# EAGLE design cape_rev_a (EAGLE 7.3.0)
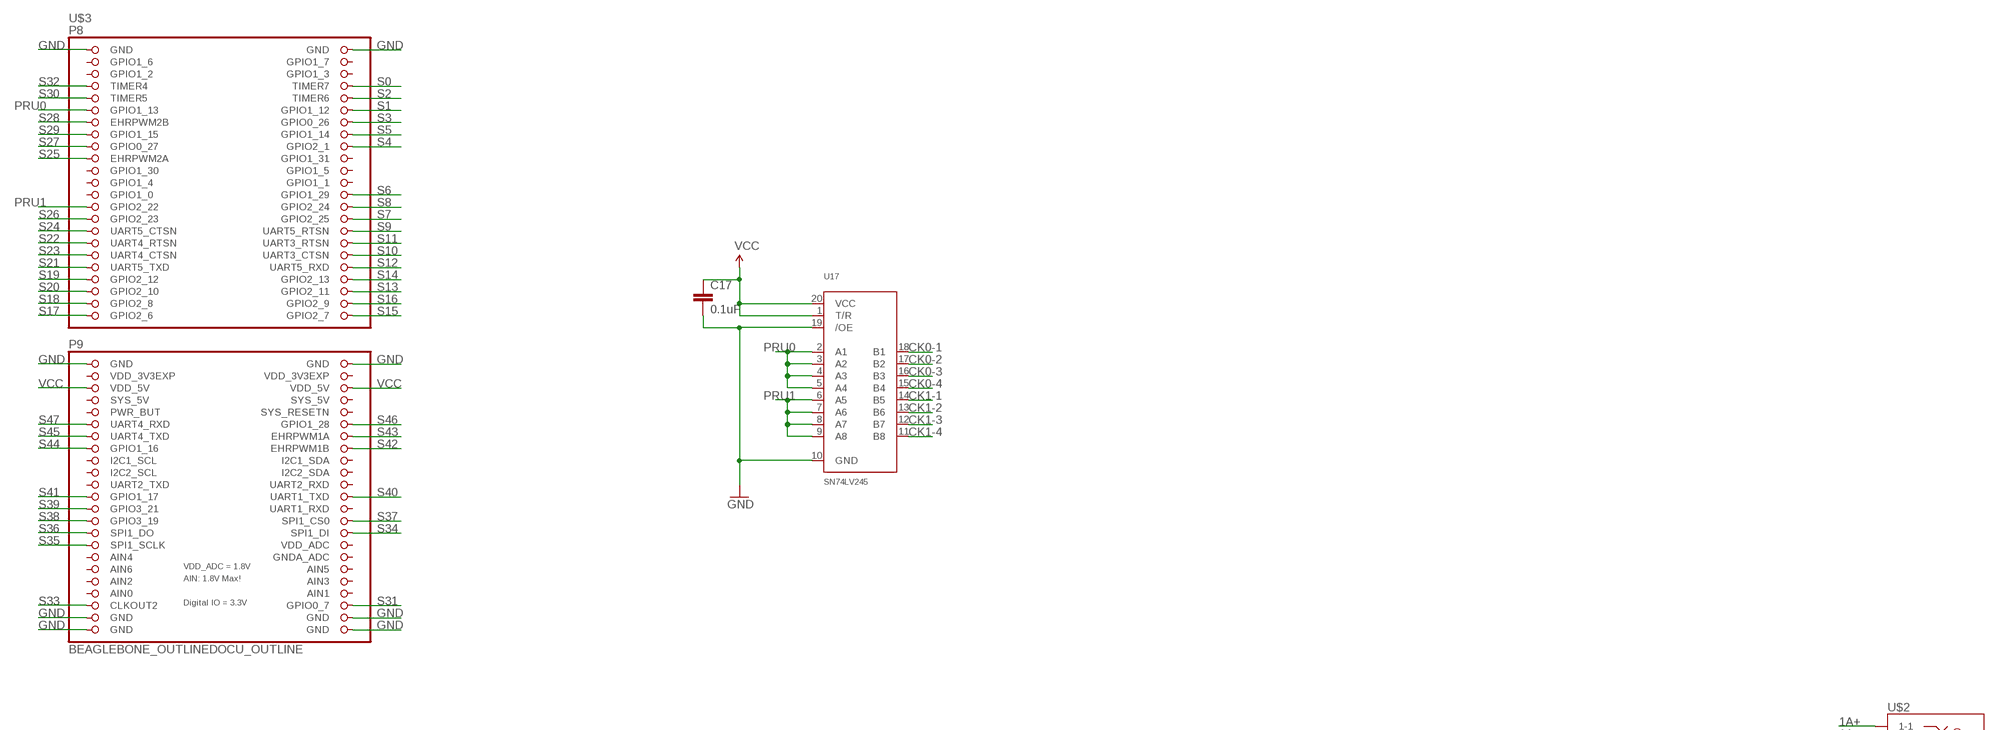
[diagram p0: schematic, sheet 1, part 1 of 2]
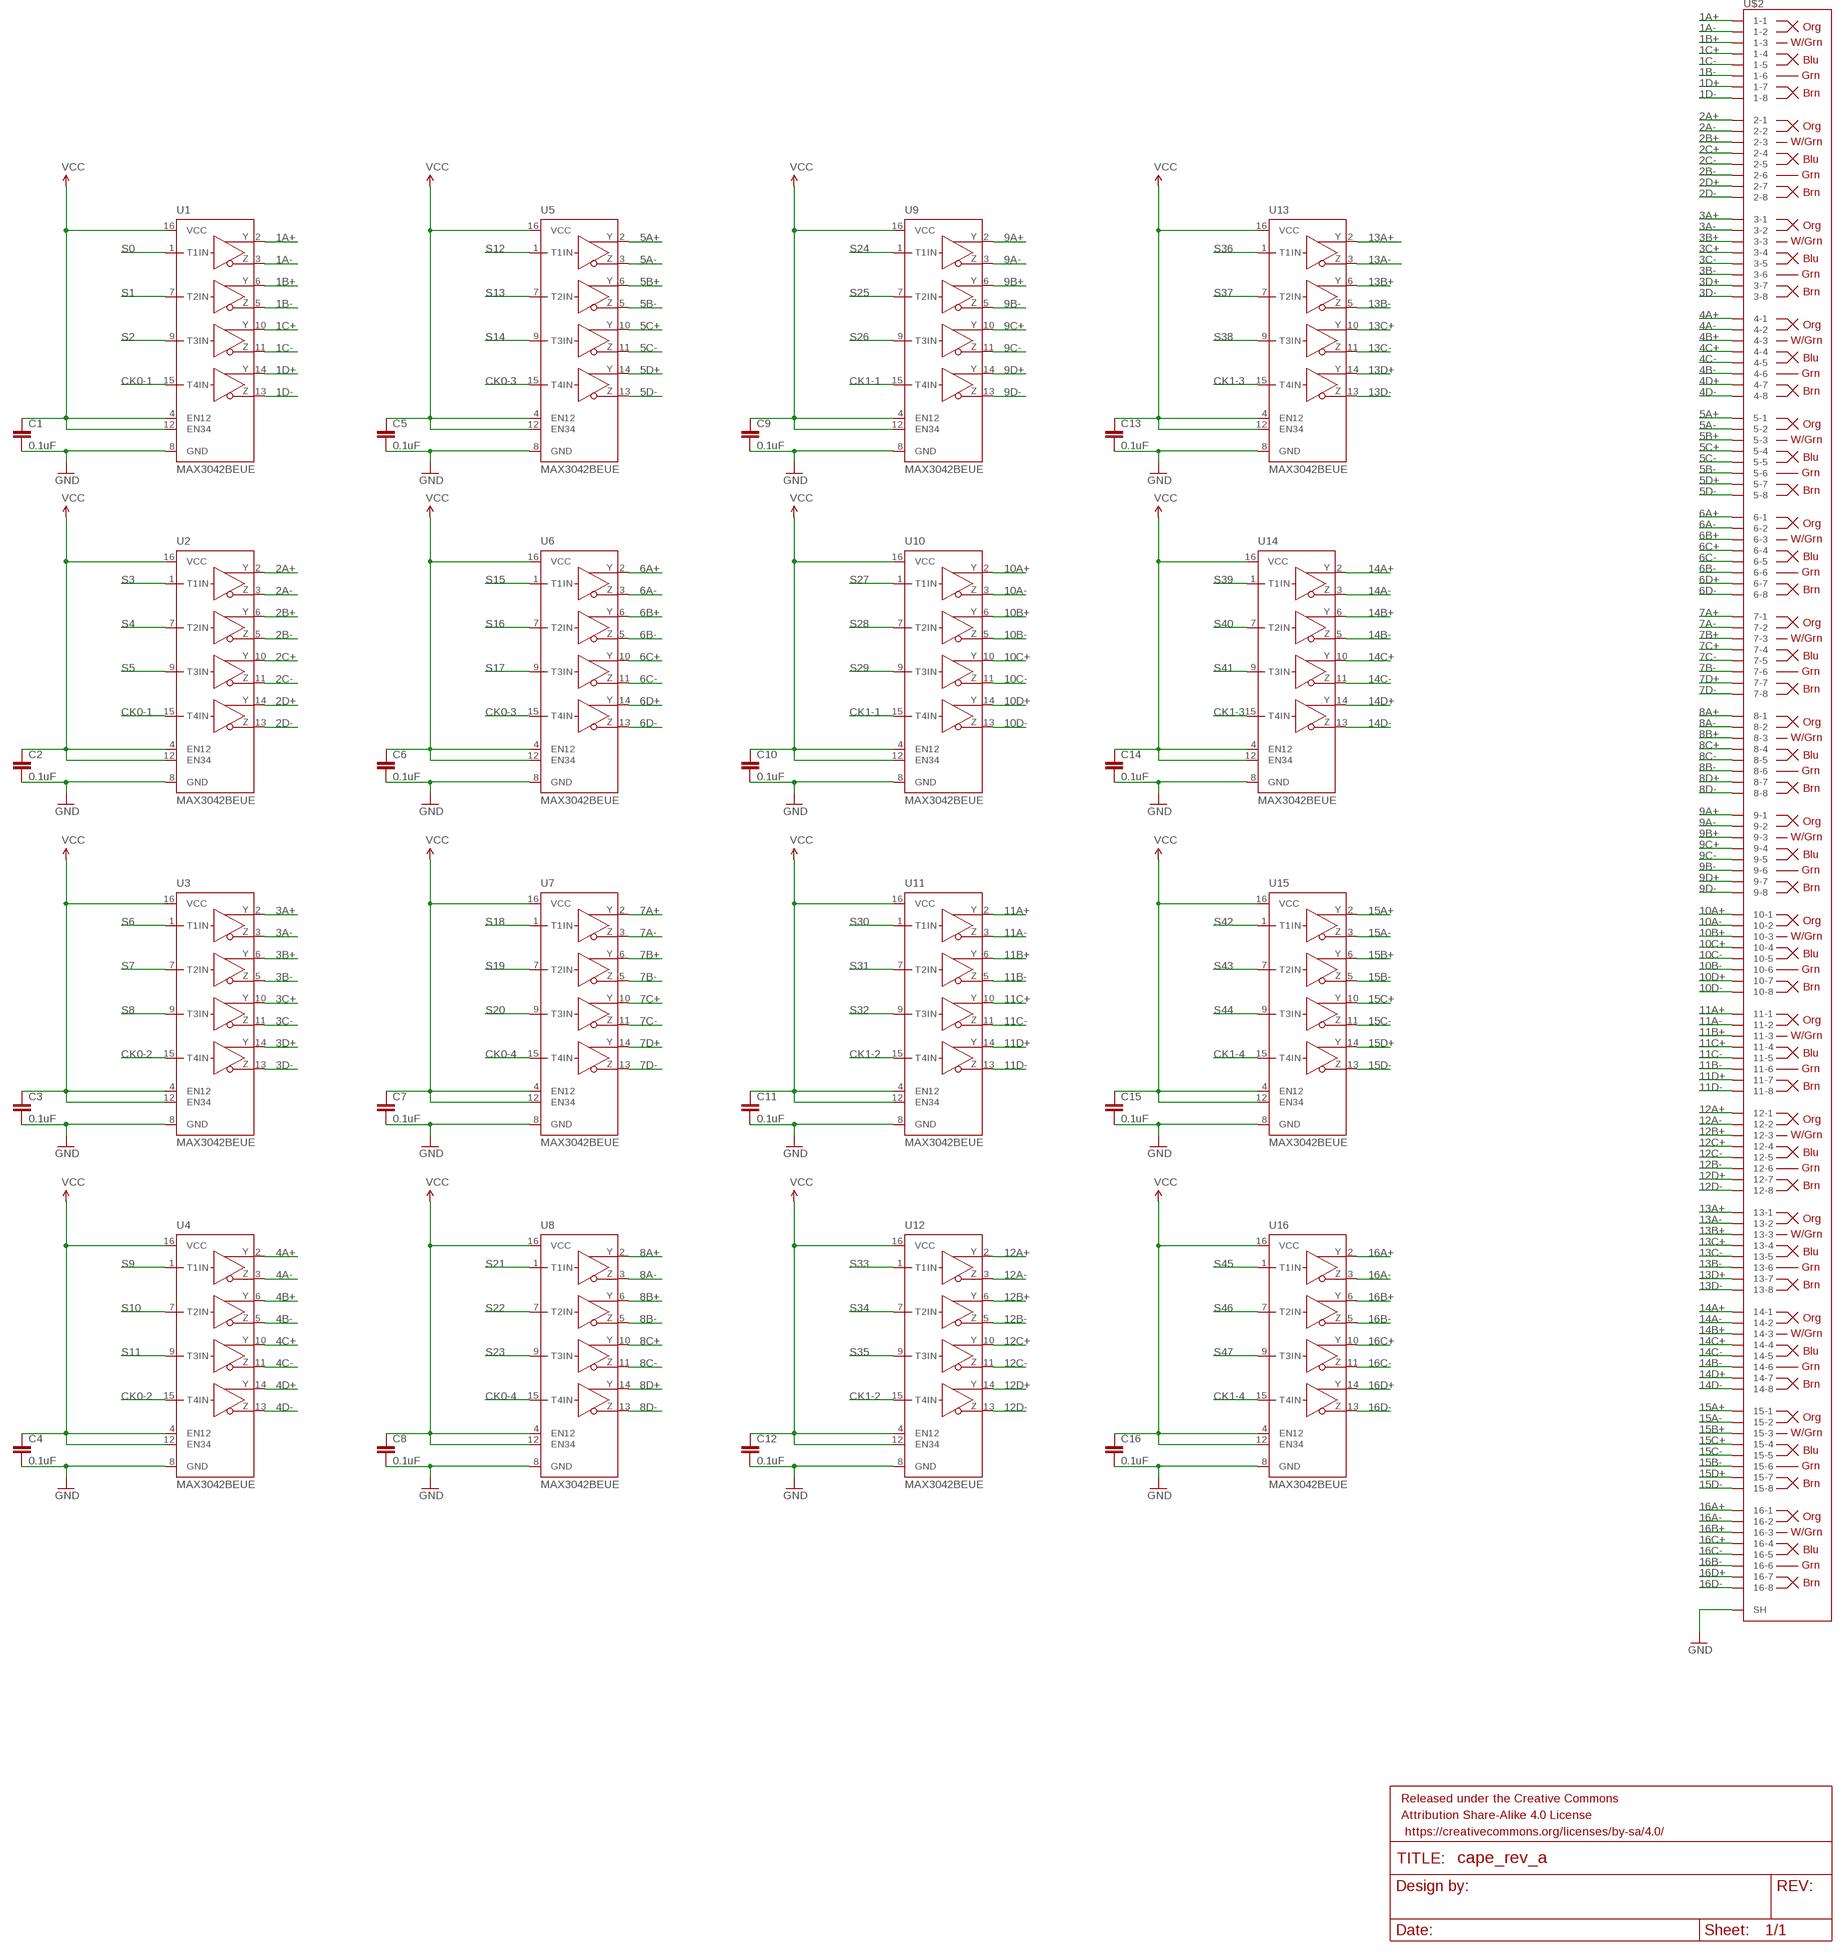
[diagram p1: schematic, sheet 1, part 2 of 2]

## Parts
C1  0.1uF  CAP0603-CAP  [0603-CAP]
C2  0.1uF  CAP0603-CAP  [0603-CAP]
C3  0.1uF  CAP0603-CAP  [0603-CAP]
C4  0.1uF  CAP0603-CAP  [0603-CAP]
C5  0.1uF  CAP0603-CAP  [0603-CAP]
C6  0.1uF  CAP0603-CAP  [0603-CAP]
C7  0.1uF  CAP0603-CAP  [0603-CAP]
C8  0.1uF  CAP0603-CAP  [0603-CAP]
C9  0.1uF  CAP0603-CAP  [0603-CAP]
C10  0.1uF  CAP0603-CAP  [0603-CAP]
C11  0.1uF  CAP0603-CAP  [0603-CAP]
C12  0.1uF  CAP0603-CAP  [0603-CAP]
C13  0.1uF  CAP0603-CAP  [0603-CAP]
C14  0.1uF  CAP0603-CAP  [0603-CAP]
C15  0.1uF  CAP0603-CAP  [0603-CAP]
C16  0.1uF  CAP0603-CAP  [0603-CAP]
C17  0.1uF  CAP0603-CAP  [0603-CAP]
FRAME1  FRAME-LETTERNO_PACKAGE  [DUMMY]
U1  MAX3042BEUE  [TSSOP16]
U2  MAX3042BEUE  [TSSOP16]
U3  MAX3042BEUE  [TSSOP16]
U4  MAX3042BEUE  [TSSOP16]
U5  MAX3042BEUE  [TSSOP16]
U6  MAX3042BEUE  [TSSOP16]
U7  MAX3042BEUE  [TSSOP16]
U8  MAX3042BEUE  [TSSOP16]
U9  MAX3042BEUE  [TSSOP16]
U10  MAX3042BEUE  [TSSOP16]
U11  MAX3042BEUE  [TSSOP16]
U12  MAX3042BEUE  [TSSOP16]
U13  MAX3042BEUE  [TSSOP16]
U14  MAX3042BEUE  [TSSOP16]
U15  MAX3042BEUE  [TSSOP16]
U16  MAX3042BEUE  [TSSOP16]
U17  SN74LV245  74LCX245  [TSSOP20]
U$2  RJ45-16  [5569264-1]
U$3  BEAGLEBONE_OUTLINEDOCU_OUTLINE  [BEAGLEBONE_OUTLINE_DOCU]

## Nets
1A+: U1.2(Y1) U$2.P1-1(1-1)
1A-: U1.3(Z1) U$2.P1-2(1-2)
1B+: U1.6(Y2) U$2.P1-3(1-3)
1B-: U1.5(Z2) U$2.P1-6(1-6)
1C+: U1.10(Y3) U$2.P1-4(1-4)
1C-: U1.11(Z3) U$2.P1-5(1-5)
1D+: U1.14(Y4) U$2.P1-7(1-7)
1D-: U1.13(Z4) U$2.P1-8(1-8)
2A+: U2.2(Y1) U$2.P2-1(2-1)
2A-: U2.3(Z1) U$2.P2-2(2-2)
2B+: U2.6(Y2) U$2.P2-3(2-3)
2B-: U2.5(Z2) U$2.P2-6(2-6)
2C+: U2.10(Y3) U$2.P2-4(2-4)
2C-: U2.11(Z3) U$2.P2-5(2-5)
2D+: U2.14(Y4) U$2.P2-7(2-7)
2D-: U2.13(Z4) U$2.P2-8(2-8)
3A+: U3.2(Y1) U$2.P3-1(3-1)
3A-: U3.3(Z1) U$2.P3-2(3-2)
3B+: U3.6(Y2) U$2.P3-3(3-3)
3B-: U3.5(Z2) U$2.P3-6(3-6)
3C+: U3.10(Y3) U$2.P3-4(3-4)
3C-: U3.11(Z3) U$2.P3-5(3-5)
3D+: U3.14(Y4) U$2.P3-7(3-7)
3D-: U3.13(Z4) U$2.P3-8(3-8)
4A+: U4.2(Y1) U$2.P4-1(4-1)
4A-: U4.3(Z1) U$2.P4-2(4-2)
4B+: U4.6(Y2) U$2.P4-3(4-3)
4B-: U4.5(Z2) U$2.P4-6(4-6)
4C+: U4.10(Y3) U$2.P4-4(4-4)
4C-: U4.11(Z3) U$2.P4-5(4-5)
4D+: U4.14(Y4) U$2.P4-7(4-7)
4D-: U4.13(Z4) U$2.P4-8(4-8)
5A+: U5.2(Y1) U$2.P5-1(5-1)
5A-: U5.3(Z1) U$2.P5-2(5-2)
5B+: U5.6(Y2) U$2.P5-3(5-3)
5B-: U5.5(Z2) U$2.P5-6(5-6)
5C+: U5.10(Y3) U$2.P5-4(5-4)
5C-: U5.11(Z3) U$2.P5-5(5-5)
5D+: U5.14(Y4) U$2.P5-7(5-7)
5D-: U5.13(Z4) U$2.P5-8(5-8)
6A+: U6.2(Y1) U$2.P6-1(6-1)
6A-: U6.3(Z1) U$2.P6-2(6-2)
6B+: U6.6(Y2) U$2.P6-3(6-3)
6B-: U6.5(Z2) U$2.P6-6(6-6)
6C+: U6.10(Y3) U$2.P6-4(6-4)
6C-: U6.11(Z3) U$2.P6-5(6-5)
6D+: U6.14(Y4) U$2.P6-7(6-7)
6D-: U6.13(Z4) U$2.P6-8(6-8)
7A+: U7.2(Y1) U$2.P7-1(7-1)
7A-: U7.3(Z1) U$2.P7-2(7-2)
7B+: U7.6(Y2) U$2.P7-3(7-3)
7B-: U7.5(Z2) U$2.P7-6(7-6)
7C+: U7.10(Y3) U$2.P7-4(7-4)
7C-: U7.11(Z3) U$2.P7-5(7-5)
7D+: U7.14(Y4) U$2.P7-7(7-7)
7D-: U7.13(Z4) U$2.P7-8(7-8)
8A+: U8.2(Y1) U$2.P8-1(8-1)
8A-: U8.3(Z1) U$2.P8-2(8-2)
8B+: U8.6(Y2) U$2.P8-3(8-3)
8B-: U8.5(Z2) U$2.P8-6(8-6)
8C+: U8.10(Y3) U$2.P8-4(8-4)
8C-: U8.11(Z3) U$2.P8-5(8-5)
8D+: U8.14(Y4) U$2.P8-7(8-7)
8D-: U8.13(Z4) U$2.P8-8(8-8)
9A+: U9.2(Y1) U$2.P9-1(9-1)
9A-: U9.3(Z1) U$2.P9-2(9-2)
9B+: U9.6(Y2) U$2.P9-3(9-3)
9B-: U9.5(Z2) U$2.P9-6(9-6)
9C+: U9.10(Y3) U$2.P9-4(9-4)
9C-: U9.11(Z3) U$2.P9-5(9-5)
9D+: U9.14(Y4) U$2.P9-7(9-7)
9D-: U9.13(Z4) U$2.P9-8(9-8)
10A+: U10.2(Y1) U$2.P10-1(10-1)
10A-: U10.3(Z1) U$2.P10-2(10-2)
10B+: U10.6(Y2) U$2.P10-3(10-3)
10B-: U10.5(Z2) U$2.P10-6(10-6)
10C+: U10.10(Y3) U$2.P10-4(10-4)
10C-: U10.11(Z3) U$2.P10-5(10-5)
10D+: U10.14(Y4) U$2.P10-7(10-7)
10D-: U10.13(Z4) U$2.P10-8(10-8)
11A+: U11.2(Y1) U$2.P11-1(11-1)
11A-: U11.3(Z1) U$2.P11-2(11-2)
11B+: U11.6(Y2) U$2.P11-3(11-3)
11B-: U11.5(Z2) U$2.P11-6(11-6)
11C+: U11.10(Y3) U$2.P11-4(11-4)
11C-: U11.11(Z3) U$2.P11-5(11-5)
11D+: U11.14(Y4) U$2.P11-7(11-7)
11D-: U11.13(Z4) U$2.P11-8(11-8)
12A+: U12.2(Y1) U$2.P12-1(12-1)
12A-: U12.3(Z1) U$2.P12-2(12-2)
12B+: U12.6(Y2) U$2.P12-3(12-3)
12B-: U12.5(Z2) U$2.P12-6(12-6)
12C+: U12.10(Y3) U$2.P12-4(12-4)
12C-: U12.11(Z3) U$2.P12-5(12-5)
12D+: U12.14(Y4) U$2.P12-7(12-7)
12D-: U12.13(Z4) U$2.P12-8(12-8)
13A+: U13.2(Y1) U$2.P13-1(13-1)
13A-: U13.3(Z1) U$2.P13-2(13-2)
13B+: U13.6(Y2) U$2.P13-3(13-3)
13B-: U13.5(Z2) U$2.P13-6(13-6)
13C+: U13.10(Y3) U$2.P13-4(13-4)
13C-: U13.11(Z3) U$2.P13-5(13-5)
13D+: U13.14(Y4) U$2.P13-7(13-7)
13D-: U13.13(Z4) U$2.P13-8(13-8)
14A+: U14.2(Y1) U$2.P14-1(14-1)
14A-: U14.3(Z1) U$2.P14-2(14-2)
14B+: U14.6(Y2) U$2.P14-3(14-3)
14B-: U14.5(Z2) U$2.P14-6(14-6)
14C+: U14.10(Y3) U$2.P14-4(14-4)
14C-: U14.11(Z3) U$2.P14-5(14-5)
14D+: U14.14(Y4) U$2.P14-7(14-7)
14D-: U14.13(Z4) U$2.P14-8(14-8)
15A+: U15.2(Y1) U$2.P15-1(15-1)
15A-: U15.3(Z1) U$2.P15-2(15-2)
15B+: U15.6(Y2) U$2.P15-3(15-3)
15B-: U15.5(Z2) U$2.P15-6(15-6)
15C+: U15.10(Y3) U$2.P15-4(15-4)
15C-: U15.11(Z3) U$2.P15-5(15-5)
15D+: U15.14(Y4) U$2.P15-7(15-7)
15D-: U15.13(Z4) U$2.P15-8(15-8)
16A+: U16.2(Y1) U$2.P16-1(16-1)
16A-: U16.3(Z1) U$2.P16-2(16-2)
16B+: U16.6(Y2) U$2.P16-3(16-3)
16B-: U16.5(Z2) U$2.P16-6(16-6)
16C+: U16.10(Y3) U$2.P16-4(16-4)
16C-: U16.11(Z3) U$2.P16-5(16-5)
16D+: U16.14(Y4) U$2.P16-7(16-7)
16D-: U16.13(Z4) U$2.P16-8(16-8)
CK0-1: U1.15(T4IN) U2.15(T4IN) U17.18(B1)
CK0-2: U3.15(T4IN) U4.15(T4IN) U17.17(B2)
CK0-3: U5.15(T4IN) U6.15(T4IN) U17.16(B3)
CK0-4: U7.15(T4IN) U8.15(T4IN) U17.15(B4)
CK1-1: U9.15(T4IN) U10.15(T4IN) U17.14(B5)
CK1-2: U11.15(T4IN) U12.15(T4IN) U17.13(B6)
CK1-3: U13.15(T4IN) U14.15(T4IN) U17.12(B7)
CK1-4: U15.15(T4IN) U16.15(T4IN) U17.11(B8)
GND: C1.2 C2.2 C3.2 C4.2 C5.2 C6.2 C7.2 C8.2 C9.2 C10.2 C11.2 C12.2 C13.2 C14.2 C15.2 C16.2 C17.2 U1.8(GND) U2.8(GND) U3.8(GND) U4.8(GND) U5.8(GND) U6.8(GND) U7.8(GND) U8.8(GND) U9.8(GND) U10.8(GND) U11.8(GND) U12.8(GND) U13.8(GND) U14.8(GND) U15.8(GND) U16.8(GND) U17.10(GND) U17.19(/OE) U$2.SH@1(SH) U$2.SH@2(SH) U$2.SH@3(SH) U$2.SH@4(SH) U$2.SH@5(SH) U$2.SH@6(SH) U$3.1(GND) U$3.2(GND) U$3.47(GND) U$3.48(GND) U$3.89(GND) U$3.90(GND) U$3.91(GND) U$3.92(GND)
PRU0: U17.2(A1) U17.3(A2) U17.4(A3) U17.5(A4) U$3.11(GPIO1_13)
PRU1: U17.6(A5) U17.7(A6) U17.8(A7) U17.9(A8) U$3.27(GPIO2_22)
S0: U1.1(T1IN) U$3.8(TIMER7)
S1: U1.7(T2IN) U$3.12(GPIO1_12)
S2: U1.9(T3IN) U$3.10(TIMER6)
S3: U2.1(T1IN) U$3.14(GPIO0_26)
S4: U2.7(T2IN) U$3.18(GPIO2_1)
S5: U2.9(T3IN) U$3.16(GPIO1_14)
S6: U3.1(T1IN) U$3.26(GPIO1_29)
S7: U3.7(T2IN) U$3.30(GPIO2_25)
S8: U3.9(T3IN) U$3.28(GPIO2_24)
S9: U4.1(T1IN) U$3.32(UART5_RTSN)
S10: U4.7(T2IN) U$3.36(UART3_CTSN)
S11: U4.9(T3IN) U$3.34(UART3_RTSN)
S12: U5.1(T1IN) U$3.38(UART5_RXD)
S13: U5.7(T2IN) U$3.42(GPIO2_11)
S14: U5.9(T3IN) U$3.40(GPIO2_13)
S15: U6.1(T1IN) U$3.46(GPIO2_7)
S16: U6.7(T2IN) U$3.44(GPIO2_9)
S17: U6.9(T3IN) U$3.45(GPIO2_6)
S18: U7.1(T1IN) U$3.43(GPIO2_8)
S19: U7.7(T2IN) U$3.39(GPIO2_12)
S20: U7.9(T3IN) U$3.41(GPIO2_10)
S21: U8.1(T1IN) U$3.37(UART5_TXD)
S22: U8.7(T2IN) U$3.33(UART4_RTSN)
S23: U8.9(T3IN) U$3.35(UART4_CTSN)
S24: U9.1(T1IN) U$3.31(UART5_CTSN)
S25: U9.7(T2IN) U$3.19(EHRPWM2A)
S26: U9.9(T3IN) U$3.29(GPIO2_23)
S27: U10.1(T1IN) U$3.17(GPIO0_27)
S28: U10.7(T2IN) U$3.13(EHRPWM2B)
S29: U10.9(T3IN) U$3.15(GPIO1_15)
S30: U11.1(T1IN) U$3.9(TIMER5)
S31: U11.7(T2IN) U$3.88(GPIO0_7)
S32: U11.9(T3IN) U$3.7(TIMER4)
S33: U12.1(T1IN) U$3.87(CLKOUT2)
S34: U12.7(T2IN) U$3.76(SPI1_DI)
S35: U12.9(T3IN) U$3.77(SPI1_SCLK)
S36: U13.1(T1IN) U$3.75(SPI1_DO)
S37: U13.7(T2IN) U$3.74(SPI1_CS0)
S38: U13.9(T3IN) U$3.73(GPIO3_19)
S39: U14.1(T1IN) U$3.71(GPIO3_21)
S40: U14.7(T2IN) U$3.70(UART1_TXD)
S41: U14.9(T3IN) U$3.69(GPIO1_17)
S42: U15.1(T1IN) U$3.62(EHRPWM1B)
S43: U15.7(T2IN) U$3.60(EHRPWM1A)
S44: U15.9(T3IN) U$3.61(GPIO1_16)
S45: U16.1(T1IN) U$3.59(UART4_TXD)
S46: U16.7(T2IN) U$3.58(GPIO1_28)
S47: U16.9(T3IN) U$3.57(UART4_RXD)
VCC: C1.1 C2.1 C3.1 C4.1 C5.1 C6.1 C7.1 C8.1 C9.1 C10.1 C11.1 C12.1 C13.1 C14.1 C15.1 C16.1 C17.1 U1.4(EN12) U1.12(EN34) U1.16(VCC) U2.4(EN12) U2.12(EN34) U2.16(VCC) U3.4(EN12) U3.12(EN34) U3.16(VCC) U4.4(EN12) U4.12(EN34) U4.16(VCC) U5.4(EN12) U5.12(EN34) U5.16(VCC) U6.4(EN12) U6.12(EN34) U6.16(VCC) U7.4(EN12) U7.12(EN34) U7.16(VCC) U8.4(EN12) U8.12(EN34) U8.16(VCC) U9.4(EN12) U9.12(EN34) U9.16(VCC) U10.4(EN12) U10.12(EN34) U10.16(VCC) U11.4(EN12) U11.12(EN34) U11.16(VCC) U12.4(EN12) U12.12(EN34) U12.16(VCC) U13.4(EN12) U13.12(EN34) U13.16(VCC) U14.4(EN12) U14.12(EN34) U14.16(VCC) U15.4(EN12) U15.12(EN34) U15.16(VCC) U16.4(EN12) U16.12(EN34) U16.16(VCC) U17.1(T/R) U17.20(VCC) U$3.51(VDD_5V) U$3.52(VDD_5V)
Unconnected: U$3.3(GPIO1_6) U$3.4(GPIO1_7) U$3.5(GPIO1_2) U$3.6(GPIO1_3) U$3.20(GPIO1_31) U$3.21(GPIO1_30) U$3.22(GPIO1_5) U$3.23(GPIO1_4) U$3.24(GPIO1_1) U$3.25(GPIO1_0) U$3.55(PWR_BUT) U$3.56(SYS_RESETN) U$3.63(I2C1_SCL) U$3.64(I2C1_SDA) U$3.65(I2C2_SCL) U$3.66(I2C2_SDA) U$3.67(UART2_TXD) U$3.68(UART2_RXD) U$3.72(UART1_RXD) U$3.79(AIN4) U$3.81(AIN6) U$3.82(AIN5) U$3.83(AIN2) U$3.84(AIN3) U$3.85(AIN0) U$3.86(AIN1)

## Power pins joined to a net without a drawn wire
GNDA_ADC: U$3.80(GNDA_ADC)
SYS_5V: U$3.53(SYS_5V) U$3.54(SYS_5V)
VDD_3V3EXP: U$3.49(VDD_3V3EXP) U$3.50(VDD_3V3EXP)
VDD_ADC: U$3.78(VDD_ADC)

## Library data of the parts
C1-C17 = SparkFun-Passives:CAP: Capacitor Standard 0603 ceramic capacitor, and 0.1" leaded capacitor.
FRAME1 = SparkFun-Aesthetics:FRAME-LETTER: Schematic Frame Standard 8.5x11 US Letter frame; DESIGNER: Nobody; VERSION: v01
U1-U16 = maxim:MAX30*: ±10kV ESD-Protected, Quad 5V RS-485/RS-422 Transmitters Source: www.maxim-ic.com .. MAX3040-MAX3045.pdf; MPN: MAX3042BEUE+; OC_FARNELL: unknown; OC_NEWARK: 57K8796
U17 = microbuilder:74LCX245: 74LCX245MTC - 5.0V Tolerant Bi-Directional Buffer Can be used to interface 5.0V logic to 2.5 or 3.3V devices Digikey: 74LCX245MTCXTR-ND Mouser: 512-74LCX245MTCX
U$2 = Custom:RJ45-16
U$3 = microbuilder:BEAGLEBONE_OUTLINE

## Board
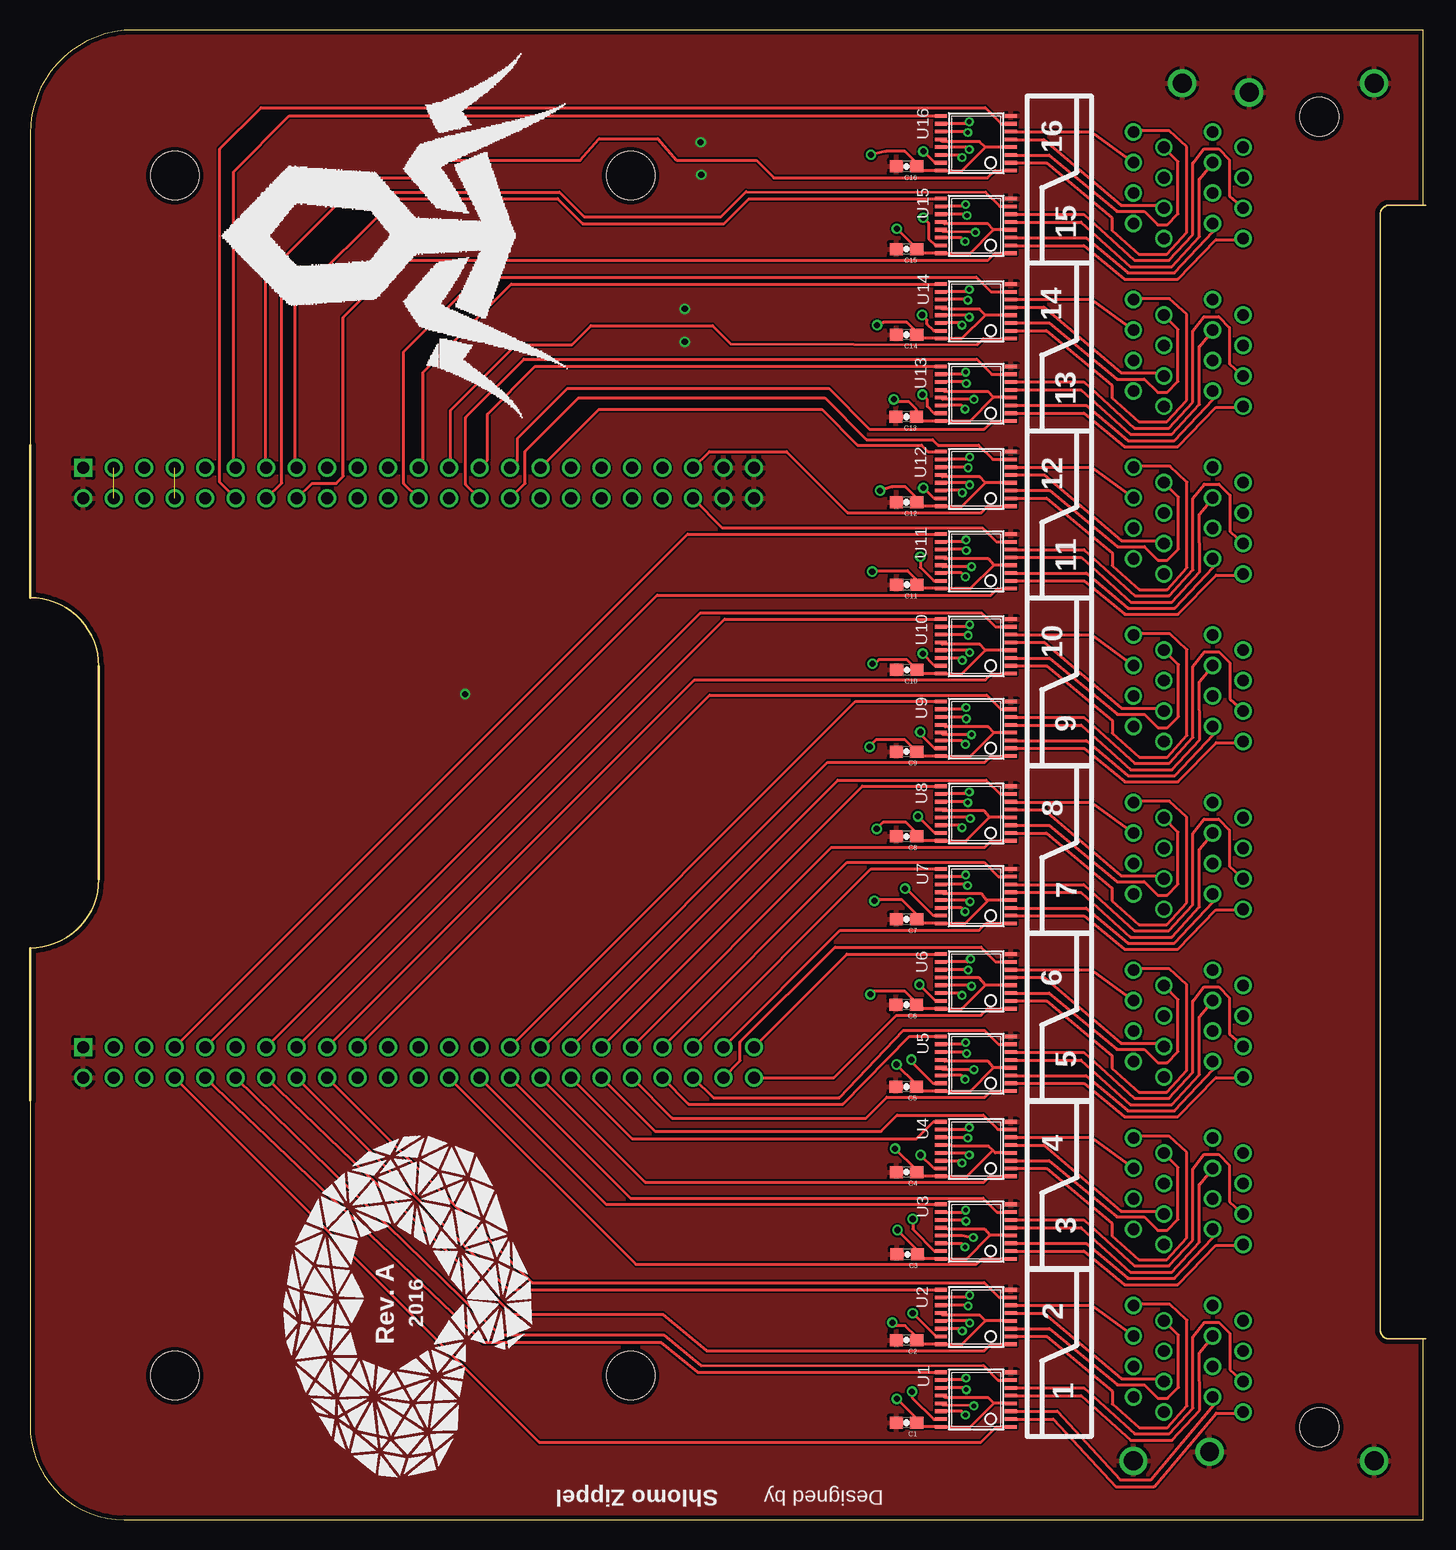
[diagram p2: board, top side]
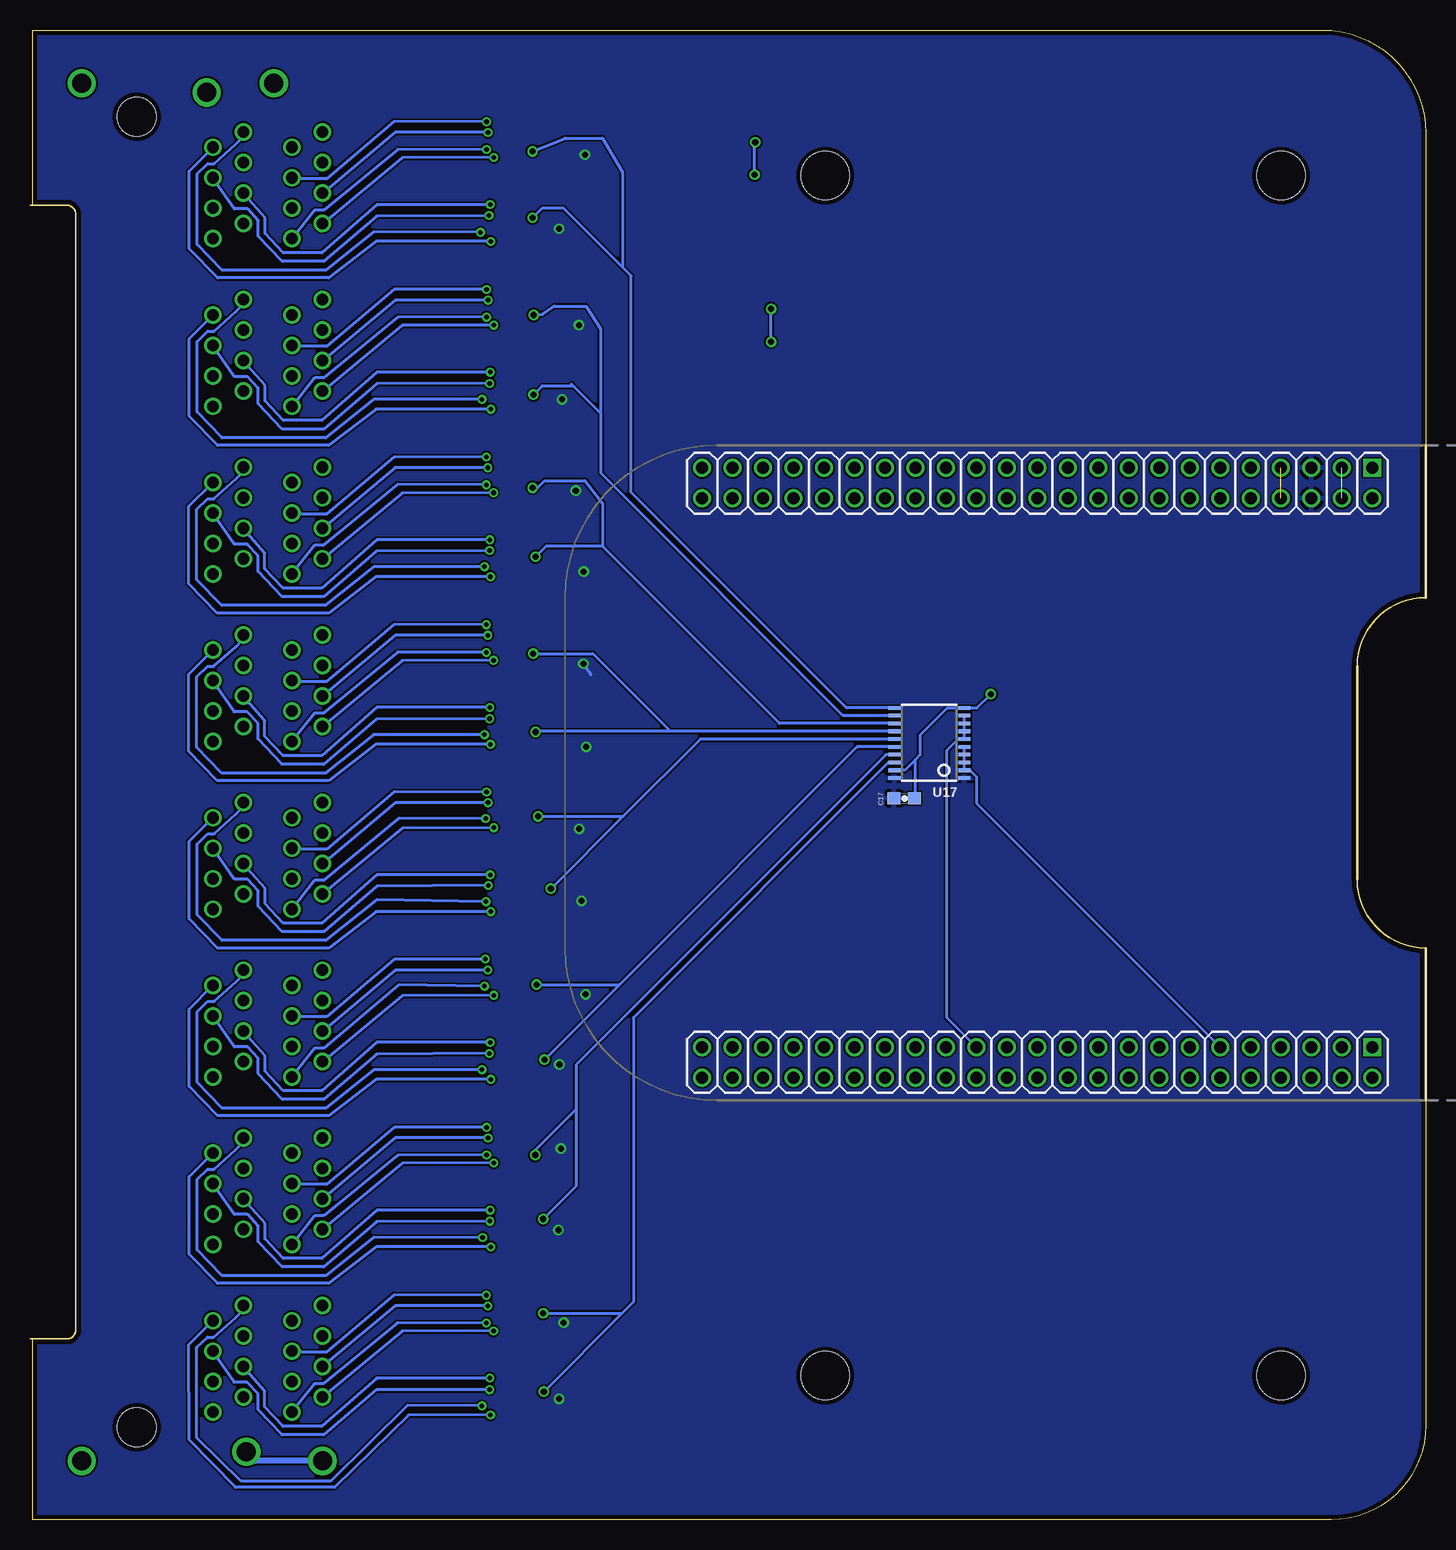
[diagram p3: board, bottom side, seen from below]

Size 116.37 x 124.14 mm. Coordinates in mm from the lower left corner, seen from the top.
Outline: 0,76.87 0.01,76.88 0.01,115.51 arc-90 8.63,124.14 116.13,124.14 116.13,109.54 116.13,109.53
Outline: 0,47.63 0.01,7.86 arc90 7.87,0 116.13,0 116.13,15.07 116.13,15.07
Copper layers (1*16): Top 0.0356mm / dielectric 1.5011mm / Bottom 0.0356mm
Design rules "PCBs_io": minimum track width 6mil, minimum drill 13mil, track to track 6mil, track to pad 6mil, pad to pad 6mil, via to via 6mil, smd to smd 6mil, copper to edge 15mil, drill to drill 6mil, minimum pad ring 7mil, minimum via ring 7mil, stop-mask expansion 3mil, vias tented up to drill 0mil, thermal gap 10mil
Holes 4 mm at 12.08,12.01 12.08,112.01 50.08,112.01 50.08,12.01

### Footprints (pad centres in the part's own frame; a part is rotated, then mirrored left to right if it is on the bottom)
0603-CAP = smd 1.1 x 1: 1 -0.85,0; 2 0.85,0
TSSOP16 = smd 0.305 x 0.991: 1 -2.275,-2.918; 2 -1.625,-2.918; 3 -0.975,-2.918; 4 -0.325,-2.918; 5 0.325,-2.918; 6 0.975,-2.918; 7 1.625,-2.918; 8 2.275,-2.918; 9 2.275,2.918; 10 1.625,2.918; 11 0.975,2.918; 12 0.325,2.918; 13 -0.325,2.918; 14 -0.975,2.918; 15 -1.625,2.918; 16 -2.275,2.918
TSSOP20 = smd 0.305 x 0.991: 1 -2.925,-2.918; 2 -2.275,-2.918; 3 -1.625,-2.918; 4 -0.975,-2.918; 5 -0.325,-2.918; 6 0.325,-2.918; 7 0.975,-2.918; 8 1.625,-2.918; 9 2.275,-2.918; 10 2.925,-2.918; 11 2.925,2.918; 12 2.275,2.918; 13 1.625,2.918; 14 0.975,2.918; 15 0.325,2.918; 16 -0.325,2.918; 17 -0.975,2.918; 18 -1.625,2.918; 19 -2.275,2.918; 20 -2.925,2.918
5569264-1 = drill 0.965: P1-1 0,0; P1-2 1.27,2.54; P1-3 2.54,0; P1-4 3.81,2.54; P1-5 5.08,0; P1-6 6.35,2.54; P1-7 7.62,0; P1-8 8.89,2.54; P2-1 8.89,9.144; P2-2 7.62,6.604; P2-3 6.35,9.144; P2-4 5.08,6.604; P2-5 3.81,9.144; P2-6 2.54,6.604; P2-7 1.27,9.144; P2-8 0,6.604; P3-1 13.97,0; P3-2 15.24,2.54; P3-3 16.51,0; P3-4 17.78,2.54; P3-5 19.05,0; P3-6 20.32,2.54; P3-7 21.59,0; P3-8 22.86,2.54; P4-1 22.86,9.144; P4-2 21.59,6.604; P4-3 20.32,9.144; P4-4 19.05,6.604; P4-5 17.78,9.144; P4-6 16.51,6.604; P4-7 15.24,9.144; P4-8 13.97,6.604; P5-1 27.94,0; P5-2 29.21,2.54; P5-3 30.48,0; P5-4 31.75,2.54; P5-5 33.02,0; P5-6 34.29,2.54; P5-7 35.56,0; P5-8 36.83,2.54; P6-1 36.83,9.144; P6-2 35.56,6.604; P6-3 34.29,9.144; P6-4 33.02,6.604; P6-5 31.75,9.144; P6-6 30.48,6.604; P6-7 29.21,9.144; P6-8 27.94,6.604; P7-1 41.91,0; P7-2 43.18,2.54; P7-3 44.45,0; P7-4 45.72,2.54; P7-5 46.99,0; P7-6 48.26,2.54; P7-7 49.53,0; P7-8 50.8,2.54; P8-1 50.8,9.144; P8-2 49.53,6.604; P8-3 48.26,9.144; P8-4 46.99,6.604; P8-5 45.72,9.144; P8-6 44.45,6.604; P8-7 43.18,9.144; P8-8 41.91,6.604; P9-1 55.88,0; P9-2 57.15,2.54; P9-3 58.42,0; P9-4 59.69,2.54; P9-5 60.96,0; P9-6 62.23,2.54; P9-7 63.5,0; P9-8 64.77,2.54; P10-1 64.77,9.144; P10-2 63.5,6.604; P10-3 62.23,9.144; P10-4 60.96,6.604; P10-5 59.69,9.144; P10-6 58.42,6.604; P10-7 57.15,9.144; P10-8 55.88,6.604; P11-1 69.85,0; P11-2 71.12,2.54; P11-3 72.39,0; P11-4 73.66,2.54; P11-5 74.93,0; P11-6 76.2,2.54; P11-7 77.47,0; P11-8 78.74,2.54; P12-1 78.74,9.144; P12-2 77.47,6.604; P12-3 76.2,9.144; P12-4 74.93,6.604; P12-5 73.66,9.144; P12-6 72.39,6.604; P12-7 71.12,9.144; P12-8 69.85,6.604; P13-1 83.82,0; P13-2 85.09,2.54; P13-3 86.36,0; P13-4 87.63,2.54; P13-5 88.9,0; P13-6 90.17,2.54; P13-7 91.44,0; P13-8 92.71,2.54; P14-1 92.71,9.144; P14-2 91.44,6.604; P14-3 90.17,9.144; P14-4 88.9,6.604; P14-5 87.63,9.144; P14-6 86.36,6.604; P14-7 85.09,9.144; P14-8 83.82,6.604; P15-1 97.79,0; P15-2 99.06,2.54; P15-3 100.33,0; P15-4 101.6,2.54; P15-5 102.87,0; P15-6 104.14,2.54; P15-7 105.41,0; P15-8 106.68,2.54; P16-1 106.68,9.144; P16-2 105.41,6.604; P16-3 104.14,9.144; P16-4 102.87,6.604; P16-5 101.6,9.144; P16-6 100.33,6.604; P16-7 99.06,9.144; P16-8 97.79,6.604 | drill 1.575: SH@1 -4.064,9.144; SH@2 -3.302,2.794; SH@3 -4.064,-10.922; SH@4 110.744,5.08; SH@5 109.982,-0.508; SH@6 110.744,-10.922 | hole 3.251: -1.27,-6.35; 107.95,-6.35
BEAGLEBONE_OUTLINE_DOCU = drill 1 square: 1 4.445,19.05; 47 52.705,19.05 | drill 1: 2 1.905,19.05; 3 4.445,21.59; 4 1.905,21.59; 5 4.445,24.13; 6 1.905,24.13; 7 4.445,26.67; 8 1.905,26.67; 9 4.445,29.21; 10 1.905,29.21; 11 4.445,31.75; 12 1.905,31.75; 13 4.445,34.29; 14 1.905,34.29; 15 4.445,36.83; 16 1.905,36.83; 17 4.445,39.37; 18 1.905,39.37; 19 4.445,41.91; 20 1.905,41.91; 21 4.445,44.45; 22 1.905,44.45; 23 4.445,46.99; 24 1.905,46.99; 25 4.445,49.53; 26 1.905,49.53; 27 4.445,52.07; 28 1.905,52.07; 29 4.445,54.61; 30 1.905,54.61; 31 4.445,57.15; 32 1.905,57.15; 33 4.445,59.69; 34 1.905,59.69; 35 4.445,62.23; 36 1.905,62.23; 37 4.445,64.77; 38 1.905,64.77; 39 4.445,67.31; 40 1.905,67.31; 41 4.445,69.85; 42 1.905,69.85; 43 4.445,72.39; 44 1.905,72.39; 45 4.445,74.93; 46 1.905,74.93; 48 50.165,19.05; 49 52.705,21.59; 50 50.165,21.59; 51 52.705,24.13; 52 50.165,24.13; 53 52.705,26.67; 54 50.165,26.67; 55 52.705,29.21; 56 50.165,29.21; 57 52.705,31.75; 58 50.165,31.75; 59 52.705,34.29; 60 50.165,34.29; 61 52.705,36.83; 62 50.165,36.83; 63 52.705,39.37; 64 50.165,39.37; 65 52.705,41.91; 66 50.165,41.91; 67 52.705,44.45; 68 50.165,44.45; 69 52.705,46.99; 70 50.165,46.99; 71 52.705,49.53; 72 50.165,49.53; 73 52.705,52.07; 74 50.165,52.07; 75 52.705,54.61; 76 50.165,54.61; 77 52.705,57.15; 78 50.165,57.15; 79 52.705,59.69; 80 50.165,59.69; 81 52.705,62.23; 82 50.165,62.23; 83 52.705,64.77; 84 50.165,64.77; 85 52.705,67.31; 86 50.165,67.31; 87 52.705,69.85; 88 50.165,69.85; 89 52.705,72.39; 90 50.165,72.39; 91 52.705,74.93; 92 50.165,74.93

### Placement (x,y rotation side)
C1  73.07,8.08 180 top
C2  73.07,14.96 180 top
C3  73.13,22.11 180 top
C4  73.07,28.97 180 top
C5  73.04,36.08 180 top
C6  73.04,42.92 180 top
C7  73.07,50.03 180 top
C8  73.07,56.94 180 top
C9  73.07,64.01 180 top
C10  73.1,70.82 180 top
C11  73.1,77.91 180 top
C12  73.07,84.79 180 top
C13  73.04,91.91 180 top
C14  73.07,98.74 180 top
C15  73.07,105.88 180 top
C16  73.07,112.77 180 top
C17  43.48,60.11 0 bottom
FRAME1  0.13,23.96 0 top
U1  78.87,10.01 90 top
U2  78.87,16.89 90 top
U3  78.87,24.01 90 top
U4  78.87,30.89 90 top
U5  78.87,37.99 90 top
U6  78.87,44.86 90 top
U7  78.87,51.96 90 top
U8  78.87,58.85 90 top
U9  78.87,65.91 90 top
U10  78.87,72.78 90 top
U11  78.87,79.86 90 top
U12  78.87,86.73 90 top
U13  78.87,93.83 90 top
U14  78.87,100.7 90 top
U15  78.87,107.82 90 top
U16  78.87,114.7 90 top
U17  41.4,64.73 90 bottom
U$2  101.13,8.96 90 top
U$3  -14.59,34.94 90 bottom

### Tracks (layer width: path | path; a pad name or v marks a point on that pad's centre or on a via)
1A+
  Top 0.254: U1.2 85.3,8.39 90.5,2.75 93.73,2.75 98.88,8.87 101.09,8.87 101.15,8.94 U$2.P1-1 | U1.2
1A-
  Top 0.254: U1.3 85.64,9.04 90.88,3.31 93.42,3.31 98.68,9.56 98.68,10.09 | 98.68,10.09 98.61,10.21 | U$2.P1-2 98.59,10.18 98.68,10.09 | U1.3
1B+
  Top 0.254: U1.6 87.86,10.99 92.1,7.15 94.97,7.15 96.95,9.31 96.95,15.25 97.89,16.44 99.11,16.44 100.03,15.53 100.03,12.5 101.15,11.48 U$2.P1-3 | U1.6
1B-
  Top 0.254: U1.5 87.65,10.34 91.77,6.61 95.2,6.61 97.51,9.13 97.49,13.93 98.61,15.29 U$2.P1-6 | U1.5
1C+  (via drill 0.38)
  Top 0.254: v78.03,11.8 77.88,11.65 75.96,11.65 U1.10
  Bottom 0.254: v78.03,11.8 87.48,11.8 92.08,7.78 95.28,7.78 96.8,9.41 96.8,10.7 98.61,12.75 U$2.P1-4
1C-  (via drill 0.38)
  Top 0.254: v78.05,10.84 77.89,11 75.96,11 U1.11
  Bottom 0.254: v78.05,10.84 87.5,10.84 91.9,7.07 95.35,7.07 97.36,9.18 97.36,10.47 98.25,11.44 99.36,11.44 101.15,14.02 U$2.P1-5
1D+  (via drill 0.38)
  Top 0.254: v77.98,8.73 77.66,9.05 75.96,9.05 U1.14
  Bottom 0.254: v77.98,8.73 84.81,8.7 90.98,2.7 99.24,2.7 103.1,6.66 103.12,14.58 U$2.P1-7
1D-  (via drill 0.38)
  Top 0.254: v78.69,9.49 76.1,9.54 76.1,9.7 75.96,9.7 U1.13
  Bottom 0.254: v78.69,9.49 84.89,9.54 91.29,3.21 98.76,3.21 102.46,6.84 102.46,14.36 101.57,15.22 101.04,15.22 99.19,16.88 98.61,17.48 98.61,17.83 U$2.P1-8
2A+
  Top 0.254: U$2.P2-1 92.01,17.83 92.12,17.94 95.02,17.94 96.44,16.62 96.44,9.48 94.79,7.65 92.48,7.65 90.22,9.66 90.22,10.7 84.73,15.27 U2.2
2A-
  Top 0.254: U$2.P2-2 95.73,15.37 95.73,11.03 94.82,10.12 94.03,10.12 92.91,11.24 90.63,11.24 84.97,15.92 U2.3
2B+
  Top 0.254: U$2.P2-3 92.01,15.29 88.48,17.87 U2.6
2B-
  Top 0.254: 94.56,11.49 94.55,11.48 | 94.55,11.48 94.15,11.74 90.98,11.74 84.54,17.22 81.81,17.22 U2.5 | 94.55,11.48 U$2.P2-6
2C+  (via drill 0.38)
  Top 0.254: v78.33,18.7 78.15,18.52 | 78.15,18.52 U2.10 | 78.17,18.52 78.15,18.52 | 75.89,18.52 U2.10 | U2.10
  Bottom 0.254: v78.33,18.7 86.03,18.73 91.67,13.95 94.49,13.95 94.55,14.02 U$2.P2-4
2C-  (via drill 0.38)
  Top 0.254: v78.21,17.81 78.15,17.87 U2.11 | 75.89,17.87 U2.11 | U2.11
  Bottom 0.254: v78.21,17.81 85.95,17.81 91.63,13.06 | 91.63,13.06 92.01,12.75 | U$2.P2-5 91.92,12.77 91.63,13.06
2D+  (via drill 0.38)
  Top 0.254: v77.72,15.73 77.53,15.92 U2.14 | 75.89,15.92 U2.14 | U2.14
  Bottom 0.254: v77.72,15.73 85.36,15.71 92.01,10.21 U$2.P2-7
2D-  (via drill 0.38)
  Top 0.254: v78.33,16.39 78.15,16.57 76,16.57 | 76,16.57 75.89,16.57 | U2.13 75.99,16.57 76,16.57
  Bottom 0.254: v78.33,16.39 85.72,16.42 91.92,11.34 92.66,11.34 94.55,8.94 U$2.P2-8
3A+
  Top 0.254: U3.2 87.84,22.38 91.24,19.59 95.68,19.59 98.86,22.87 101.07,22.87 U$2.P3-1
3A-
  Top 0.254: U3.3 88.03,23.03 91.52,20.1 95.4,20.1 98.65,23.56 98.65,24.08 U$2.P3-2
3B+
  Top 0.254: U3.6 87.83,24.98 92.08,21.14 94.95,21.14 96.93,23.3 96.93,29.24 97.87,30.44 99.09,30.44 100,29.52 100,26.5 U$2.P3-3
3B-
  Top 0.254: U3.5 87.62,24.33 91.75,20.61 95.17,20.61 97.49,23.12 97.46,27.93 U$2.P3-6
3C+  (via drill 0.38)
  Top 0.254: U3.10 77.66,25.63 v78,25.8
  Bottom 0.254: v78,25.8 87.45,25.8 92.05,21.78 95.25,21.78 96.77,23.4 96.77,24.7 U$2.P3-4
3C-  (via drill 0.38)
  Top 0.254: U3.11 77.75,24.98 v78.03,24.88
  Bottom 0.254: v78.03,24.88 87.48,24.83 91.87,21.07 95.33,21.07 97.33,23.17 97.33,24.47 98.22,25.43 99.34,25.43 U$2.P3-5
3D+  (via drill 0.38)
  Top 0.254: U3.14 77.67,23.03 v77.95,22.73
  Bottom 0.254: v77.95,22.73 87.53,22.73 91.47,19.69 100.74,19.69 103.1,22.13 103.1,28.58 U$2.P3-7
3D-  (via drill 0.38)
  Top 0.254: U3.13 77.7,23.68 v78.64,23.51
  Bottom 0.254: v78.64,23.51 87.7,23.54 91.72,20.33 100.36,20.33 102.44,22.49 102.44,28.36 101.55,29.22 101.01,29.22 99.16,30.87 98.59,31.47 U$2.P3-8
4A+
  Top 0.254: U4.2 84.71,29.27 90.2,24.7 90.2,23.66 92.46,21.65 94.77,21.65 96.42,23.48 96.42,30.62 95,31.94 92.1,31.94 U$2.P4-1
4A-
  Top 0.254: U4.3 84.95,29.92 90.6,25.23 92.89,25.23 94.01,24.11 94.79,24.11 95.71,25.03 95.71,29.37 U$2.P4-2
4B+
  Top 0.254: U4.6 88.45,31.87 U$2.P4-3
4B-
  Top 0.254: U4.5 84.51,31.22 90.93,25.71 94.1,25.71 U$2.P4-6
4C+  (via drill 0.38)
  Top 0.254: U4.10 78.08,32.52 v78.31,32.7
  Bottom 0.254: v78.31,32.7 86,32.72 91.64,27.95 94.46,27.95 U$2.P4-4
4C-  (via drill 0.38)
  Top 0.254: U4.11 77.84,31.87 v78.18,31.81
  Bottom 0.254: v78.18,31.81 85.92,31.81 U$2.P4-5
4D+  (via drill 0.38)
  Top 0.254: U4.14 77.4,29.92 v77.7,29.73
  Bottom 0.254: v77.7,29.73 85.34,29.7 U$2.P4-7
4D-  (via drill 0.38)
  Top 0.254: U4.13 78.13,30.57 v78.31,30.39
  Bottom 0.254: v78.31,30.39 85.7,30.41 91.9,25.33 92.63,25.33 U$2.P4-8
5A+
  Top 0.254: U$2.P5-1 101.07,36.84 98.86,36.84 95.68,33.56 91.24,33.56 87.84,36.35 81.79,36.35 U5.2
5A-
  Top 0.254: U$2.P5-2 98.65,38.05 98.65,37.53 95.4,34.07 91.52,34.07 88.03,37 81.79,37 U5.3
5B+
  Top 0.254: U$2.P5-3 100,40.47 100,43.49 99.09,44.41 97.87,44.41 96.93,43.21 96.93,37.27 94.95,35.11 92.08,35.11 87.83,38.95 81.79,38.95 U5.6
5B-
  Top 0.254: 81.79,38.3 81.8,38.3 | 81.8,38.3 87.62,38.3 91.75,34.58 95.17,34.58 97.49,37.09 97.46,41.9 U$2.P5-6 | U5.5 81.8,38.3
5C+  (via drill 0.38)
  Top 0.254: v78,39.77 77.85,39.62 U5.10
  Bottom 0.254: v78,39.77 87.45,39.77 92.05,35.75 95.25,35.75 96.77,37.37 96.77,38.67 U$2.P5-4
5C-  (via drill 0.38)
  Top 0.254: v78.08,38.85 77.86,38.97 U5.11
  Bottom 0.254: v78.08,38.85 87.48,38.8 91.87,35.04 95.33,35.04 97.33,37.14 97.33,38.44 98.22,39.4 99.34,39.4 U$2.P5-5
5D+  (via drill 0.38)
  Top 0.254: v77.95,36.7 77.63,37.02 U5.14
  Bottom 0.254: v77.95,36.7 87.53,36.7 91.47,33.66 100.74,33.66 103.1,36.1 103.1,42.55 U$2.P5-7
5D-  (via drill 0.38)
  Top 0.254: v78.69,37.51 76.07,37.51 U5.13
  Bottom 0.254: v78.69,37.51 87.7,37.51 91.72,34.3 100.36,34.3 102.44,36.46 102.44,42.33 101.55,43.19 101.01,43.19 99.16,44.84 98.59,45.44 U$2.P5-8
6A+
  Top 0.254: U$2.P6-1 92.1,45.91 95,45.91 96.42,44.59 96.42,37.45 94.77,35.62 92.46,35.62 90.2,37.63 90.2,38.67 84.71,43.24 U6.2
6A-
  Top 0.254: U$2.P6-2 95.71,43.34 95.71,39 94.79,38.08 94.01,38.08 92.89,39.2 90.6,39.2 84.95,43.89 U6.3
6B+
  Top 0.254: U6.6 | U6.6 88.45,45.84 U$2.P6-3 | U6.6
6B-
  Top 0.254: 94.54,39.46 U$2.P6-6 94.13,39.68 90.96,39.68 84.51,45.19 U6.5 | U6.5 | U6.5
6C+  (via drill 0.38)
  Top 0.254: v78.41,46.72 78.12,46.48 U6.10 | 75.89,46.48 U6.10 | 78.15,46.48 U6.10
  Bottom 0.254: v78.41,46.72 86,46.69 91.64,41.92 94.46,41.92 U$2.P6-4
6C-  (via drill 0.38)
  Top 0.254: v78.21,45.8 78.12,45.83 U6.11
  Bottom 0.254: v78.21,45.8 85.92,45.78 U$2.P6-5
6D+  (via drill 0.38)
  Top 0.254: v77.7,43.7 77.51,43.88 U6.14
  Bottom 0.254: v77.7,43.7 85.34,43.67 U$2.P6-7
6D-  (via drill 0.38)
  Top 0.254: v78.48,44.46 78.13,44.53 U6.13
  Bottom 0.254: v78.48,44.46 85.65,44.56 91.9,39.3 92.63,39.3 U$2.P6-8
7A+
  Top 0.254: U$2.P7-1 101.07,50.81 98.86,50.81 95.68,47.53 91.24,47.53 87.84,50.32 81.79,50.32 U7.2
7A-
  Top 0.254: U$2.P7-2 98.65,52.02 98.65,51.5 95.4,48.04 91.52,48.04 88.03,50.97 81.79,50.97 U7.3
7B+
  Top 0.254: U$2.P7-3 100,54.44 100,57.46 99.09,58.38 97.87,58.38 96.93,57.18 96.93,51.24 94.95,49.08 92.08,49.08 87.83,52.92 81.79,52.92 U7.6
7B-
  Top 0.254: 81.79,52.27 81.8,52.27 | 81.8,52.27 87.62,52.27 91.75,48.55 95.17,48.55 97.49,51.06 97.46,55.87 U$2.P7-6 | U7.5 81.8,52.27
7C+  (via drill 0.38)
  Top 0.254: v78,53.74 77.85,53.59 U7.10
  Bottom 0.254: v78,53.74 87.45,53.74 92.05,49.72 95.25,49.72 96.77,51.34 96.77,52.64 U$2.P7-4
7C-  (via drill 0.38)
  Top 0.254: v78.15,52.85 77.86,52.94 U7.11
  Bottom 0.254: v78.15,52.85 87.48,52.77 91.87,49.01 95.33,49.01 97.33,51.11 97.33,52.41 98.22,53.37 99.34,53.37 U$2.P7-5
7D+  (via drill 0.38)
  Top 0.254: v77.95,50.67 77.63,50.99 U7.14
  Bottom 0.254: v77.95,50.67 87.53,50.67 91.47,47.63 100.74,47.63 103.1,50.07 103.1,56.52 U$2.P7-7
7D-  (via drill 0.38)
  Top 0.254: v78.36,51.5 77.89,51.64 U7.13
  Bottom 0.254: v78.36,51.5 87.45,51.68 91.72,48.27 100.36,48.27 102.44,50.43 102.44,56.3 101.55,57.16 101.01,57.16 99.16,58.81 98.59,59.41 U$2.P7-8
8A+
  Top 0.254: 81.79,57.21 81.8,57.21 | 81.8,57.21 84.71,57.21 90.2,52.64 90.2,51.6 92.46,49.59 94.77,49.59 96.42,51.42 96.42,58.56 95,59.88 92.1,59.88 U$2.P8-1 | U8.2 81.8,57.21
8A-
  Top 0.254: 81.79,57.86 81.8,57.86 | 81.8,57.86 84.95,57.86 90.6,53.17 92.89,53.17 94.01,52.05 94.79,52.05 95.71,52.97 95.71,57.31 U$2.P8-2 | U8.3 81.8,57.86
8B+
  Top 0.254: 81.79,59.81 81.8,59.81 | 81.8,59.81 88.45,59.81 U$2.P8-3 | U8.6 81.8,59.81
8B-
  Top 0.254: U$2.P8-6 94.13,53.65 90.96,53.65 84.51,59.16 81.79,59.16 U8.5
8C+  (via drill 0.38)
  Top 0.254: v78.31,60.64 78.14,60.48 U8.10
  Bottom 0.254: v78.31,60.64 86,60.66 91.64,55.89 94.46,55.89 U$2.P8-4
8C-  (via drill 0.38)
  Top 0.254: v78.18,59.75 78.1,59.83 U8.11
  Bottom 0.254: v78.18,59.75 85.92,59.75 U$2.P8-5
8D+  (via drill 0.38)
  Top 0.254: v77.7,57.67 77.49,57.88 U8.14
  Bottom 0.254: v77.7,57.67 85.34,57.64 U$2.P8-7
8D-  (via drill 0.38)
  Top 0.254: v78.38,58.43 78.11,58.53 U8.13
  Bottom 0.254: v78.38,58.43 85.65,58.45 91.9,53.27 92.63,53.27 U$2.P8-8
9A+
  Top 0.254: U$2.P9-1 101.15,64.82 101.09,64.75 98.88,64.75 95.71,61.48 91.26,61.48 87.87,64.27 81.8,64.27 U9.2
9A-
  Top 0.254: U$2.P9-2 98.61,66.09 98.68,65.97 98.68,65.44 95.43,61.99 91.54,61.99 88.06,64.92 81.8,64.92 U9.3
9B+
  Top 0.254: 101.01,67.49 100.03,68.38 100.03,71.41 99.11,72.32 97.89,72.32 96.95,71.13 96.95,65.19 94.97,63.03 92.1,63.03 87.86,66.87 81.8,66.87 U9.6 | 101.01,67.49 101.15,67.36 | U$2.P9-3 101.11,67.38 101.01,67.49
9B-
  Top 0.254: U$2.P9-6 98.61,71.17 97.49,69.81 97.51,65.01 95.2,62.49 91.77,62.49 87.65,66.22 81.8,66.22 U9.5
9C+  (via drill 0.38)
  Top 0.254: v78.03,67.68 77.88,67.53 U9.10
  Bottom 0.254: v78.03,67.68 87.48,67.68 92.08,63.66 95.28,63.66 96.8,65.29 96.8,66.58 98.61,68.63 U$2.P9-4
9C-  (via drill 0.38)
  Top 0.254: v78.05,66.74 77.89,66.88 U9.11
  Bottom 0.254: v78.05,66.74 87.5,66.72 91.9,62.95 95.35,62.95 97.36,65.06 97.36,66.35 98.25,67.32 99.36,67.32 101.15,69.9 U$2.P9-5
9D+  (via drill 0.38)
  Top 0.254: v77.98,64.61 77.66,64.93 U9.14
  Bottom 0.254: v77.98,64.61 87.55,64.61 91.49,61.58 100.76,61.58 103.12,64.02 103.12,70.46 U$2.P9-7
9D-  (via drill 0.38)
  Top 0.254: v78.48,65.42 76.1,65.42 76.1,65.58 U9.13
  Bottom 0.254: v78.48,65.42 87.73,65.42 91.75,62.21 100.38,62.21 102.46,64.37 102.46,70.24 101.57,71.1 101.04,71.1 99.19,72.76 98.76,73.21 | 98.76,73.21 98.61,73.36 98.61,73.71 | U$2.P9-8 98.59,73.37 98.76,73.21
10A+
  Top 0.254: U$2.P10-1 92.01,73.71 92.12,73.82 95.02,73.82 96.44,72.5 96.44,65.36 94.79,63.53 92.48,63.53 90.22,65.54 90.22,66.58 84.73,71.15 U10.2
10A-
  Top 0.254: U$2.P10-2 95.73,71.25 95.73,66.91 94.82,66 94.03,66 92.91,67.12 90.63,67.12 84.97,71.8 U10.3
10B+
  Top 0.254: 91.82,71.3 88.48,73.75 81.81,73.75 81.81,73.76 U10.6 | 91.82,71.3 92.01,71.17 | U$2.P10-3 91.93,71.19 91.82,71.3
10B-
  Top 0.254: 94.55,67.36 94.56,67.37 | 94.55,67.36 94.15,67.62 90.98,67.62 84.54,73.1 U10.5 | U$2.P10-6 94.55,67.36
10C+  (via drill 0.38)
  Top 0.254: v78.33,74.58 78.15,74.4 | 78.15,74.4 U10.10 | U10.10 75.89,74.4 | 78.17,74.4 78.15,74.4 | U10.10
  Bottom 0.254: v78.33,74.58 86.03,74.61 91.67,69.83 94.49,69.83 94.55,69.9 U$2.P10-4
10C-  (via drill 0.38)
  Top 0.254: v78.21,73.69 78.15,73.75 U10.11 | 75.89,73.75 U10.11 | U10.11
  Bottom 0.254: v78.21,73.69 85.95,73.69 92.01,68.63 U$2.P10-5
10D+  (via drill 0.38)
  Top 0.254: v77.72,71.61 77.53,71.8 U10.14 | 75.89,71.8 U10.14 | U10.14
  Bottom 0.254: v77.72,71.61 85.36,71.59 92.01,66.09 U$2.P10-7 91.95,66.11 91.8,66.26
10D-  (via drill 0.38)
  Top 0.254: v78.33,72.27 78.15,72.45 U10.13 | 75.89,72.45 U10.13 | U10.13
  Bottom 0.254: v78.33,72.27 85.72,72.3 91.92,67.22 92.66,67.22 94.55,64.82 U$2.P10-8
11A+
  Top 0.254: U$2.P11-1 101.15,78.79 101.09,78.72 98.88,78.72 95.71,75.45 91.26,75.45 87.87,78.24 U11.2
11A-
  Top 0.254: U$2.P11-2 98.61,80.06 98.68,79.94 98.68,79.41 95.43,75.96 91.54,75.96 88.06,78.89 81.81,78.89 U11.3
11B+
  Top 0.254: U$2.P11-3 101.15,81.33 100.03,82.35 100.03,85.38 99.11,86.29 97.89,86.29 96.95,85.1 96.95,79.16 94.97,77 92.1,77 87.86,80.84 U11.6
11B-
  Top 0.254: U$2.P11-6 98.61,85.14 97.49,83.78 97.51,78.98 95.2,76.46 91.77,76.46 87.65,80.19 U11.5
11C+  (via drill 0.38)
  Top 0.254: v78.03,81.65 77.88,81.5 76.1,81.5 76.08,81.49 U11.10
  Bottom 0.254: v78.03,81.65 87.48,81.65 92.08,77.63 95.28,77.63 96.8,79.26 96.8,80.55 98.61,82.6 U$2.P11-4
11C-  (via drill 0.38)
  Top 0.254: v78.05,80.76 77.89,80.85 75.96,80.85 U11.11
  Bottom 0.254: v78.05,80.76 87.5,80.69 91.9,76.92 95.35,76.92 97.36,79.03 97.36,80.32 98.25,81.29 99.36,81.29 101.15,83.87 U$2.P11-5
11D+  (via drill 0.38)
  Top 0.254: v77.98,78.58 77.66,78.9 75.96,78.9 U11.14
  Bottom 0.254: v77.98,78.58 87.55,78.58 91.49,75.55 100.76,75.55 103.12,77.99 103.12,84.43 U$2.P11-7
11D-  (via drill 0.38)
  Top 0.254: v78.48,79.42 76.1,79.39 76.1,79.55 75.96,79.55 U11.13
  Bottom 0.254: v78.48,79.42 87.73,79.39 91.75,76.18 100.38,76.18 102.46,78.34 102.46,84.21 101.57,85.07 101.04,85.07 99.19,86.73 98.61,87.33 98.61,87.68 U$2.P11-8
12A+
  Top 0.254: U$2.P12-1 92.01,87.68 92.12,87.79 95.02,87.79 96.44,86.47 96.44,79.33 94.79,77.5 92.48,77.5 90.22,79.51 90.22,80.55 84.73,85.12 81.8,85.12 U12.2
12A-
  Top 0.254: U$2.P12-2 95.73,85.22 95.73,80.88 94.82,79.97 94.03,79.97 92.91,81.09 90.63,81.09 84.97,85.77 81.8,85.77 U12.3
12B+
  Top 0.254: U$2.P12-3 92.01,85.14 88.48,87.72 81.8,87.72 U12.6
12B-
  Top 0.254: 94.55,81.33 94.56,81.34 | 94.55,81.33 94.15,81.59 90.98,81.59 84.54,87.07 81.8,87.07 U12.5 | U$2.P12-6 94.55,81.33
12C+  (via drill 0.38)
  Top 0.254: v78.33,88.55 78.15,88.37 | 78.15,88.37 75.94,88.37 | 75.94,88.37 75.89,88.37 | 78.17,88.37 78.15,88.37 | 75.94,88.37 U12.10
  Bottom 0.254: v78.33,88.55 86.03,88.58 91.67,83.8 94.49,83.8 94.55,83.87 U$2.P12-4
12C-  (via drill 0.38)
  Top 0.254: v78.21,87.66 78.15,87.72 75.94,87.72 | 75.89,87.72 75.94,87.72 | 75.94,87.72 U12.11
  Bottom 0.254: v78.21,87.66 85.95,87.66 92.01,82.6 U$2.P12-5
12D+  (via drill 0.38)
  Top 0.254: v77.72,85.58 77.53,85.77 75.94,85.77 | 75.89,85.77 75.94,85.77 | 75.94,85.77 U12.14
  Bottom 0.254: v77.72,85.58 85.36,85.56 92.01,80.06 U$2.P12-7
12D-  (via drill 0.38)
  Top 0.254: v78.33,86.24 78.15,86.42 75.94,86.42 | 75.89,86.42 75.94,86.42 | 75.94,86.42 U12.13
  Bottom 0.254: v78.33,86.24 85.72,86.27 91.92,81.19 92.66,81.19 94.42,78.94 | 94.42,78.94 94.55,78.79 | U$2.P12-8 94.52,78.84 94.42,78.94
13A+
  Top 0.254: 100.75,92.69 98.86,92.69 95.68,89.42 91.24,89.42 87.84,92.21 U13.2 | 100.75,92.69 101.07,92.69 101.13,92.76 | U$2.P13-1 100.83,92.78 100.75,92.69
13A-
  Top 0.254: U13.3 | U13.3 88.03,92.86 91.52,89.93 95.4,89.93 98.65,93.38 98.65,93.91 98.59,94.03 U$2.P13-2 | U13.3
13B+
  Top 0.254: U$2.P13-3 101.13,95.3 100,96.32 100,99.35 99.09,100.26 97.87,100.26 96.93,99.07 96.93,93.13 94.95,90.97 92.08,90.97 87.83,94.81 U13.6
13B-
  Top 0.254: U13.5 | U13.5 87.62,94.16 91.75,90.43 95.17,90.43 97.49,92.95 97.46,97.75 98.59,99.11 U$2.P13-6 | U13.5
13C+  (via drill 0.38)
  Top 0.254: v78,95.62 77.85,95.47 75.97,95.47 U13.10
  Bottom 0.254: v78,95.62 87.45,95.62 92.05,91.6 95.25,91.6 96.77,93.23 96.77,94.52 98.59,96.57 U$2.P13-4
13C-  (via drill 0.38)
  Top 0.254: v78.05,94.68 77.86,94.82 75.97,94.82 U13.11
  Bottom 0.254: v78.05,94.68 87.48,94.66 91.87,90.89 95.33,90.89 97.33,93 97.33,94.29 98.22,95.26 99.34,95.26 101.13,97.84 U$2.P13-5
13D+  (via drill 0.38)
  Top 0.254: v77.95,92.55 77.63,92.87 75.97,92.87 U13.14
  Bottom 0.254: v77.95,92.55 87.53,92.55 91.47,89.52 100.74,89.52 103.1,91.96 103.1,98.4 101.13,100.38 U$2.P13-7
13D-  (via drill 0.38)
  Top 0.254: v78.69,93.36 76.07,93.36 76.07,93.52 75.97,93.52 U13.13
  Bottom 0.254: v78.69,93.36 87.7,93.36 91.72,90.15 100.36,90.15 102.44,92.31 102.44,98.18 101.55,99.04 101.01,99.04 99.16,100.7 98.59,101.3 U$2.P13-8
14A+
  Top 0.254: 92.01,101.67 91.98,101.65 | U$2.P14-1 92.01,101.67 | 92.01,101.67 92.1,101.76 95,101.76 96.42,100.44 96.42,93.3 94.77,91.47 92.46,91.47 90.2,93.48 90.2,94.52 84.71,99.09 81.79,99.09 U14.2
14A-
  Top 0.254: U$2.P14-2 94.52,100.38 95.71,99.19 95.71,94.85 94.79,93.94 94.01,93.94 92.89,95.06 90.6,95.06 84.95,99.74 81.79,99.74 U14.3
14B+
  Top 0.254: U$2.P14-3 91.98,99.11 88.45,101.69 81.79,101.69 U14.6
14B-
  Top 0.254: 94.52,95.3 94.53,95.3 94.54,95.31 | 94.52,95.3 94.13,95.56 90.96,95.56 84.51,101.04 81.79,101.04 U14.5 | U$2.P14-6 94.52,95.3
14C+  (via drill 0.38)
  Top 0.254: v78.31,102.52 78.12,102.34 | 78.12,102.34 75.93,102.34 | 78.15,102.34 78.12,102.34 | 75.87,102.34 75.93,102.34 | 75.93,102.34 U14.10
  Bottom 0.254: v78.31,102.52 86,102.55 91.64,97.77 94.46,97.77 94.52,97.84 U$2.P14-4
14C-  (via drill 0.38)
  Top 0.254: v78.18,101.63 78.12,101.69 75.93,101.69 | 75.87,101.69 75.93,101.69 | 75.93,101.69 U14.11
  Bottom 0.254: v78.18,101.63 85.92,101.63 91.98,96.57 U$2.P14-5
14D+  (via drill 0.38)
  Top 0.254: v77.7,99.55 77.51,99.74 75.93,99.74 | 75.87,99.74 75.93,99.74 | 75.93,99.74 U14.14
  Bottom 0.254: v77.7,99.55 85.34,99.53 91.98,94.03 U$2.P14-7
14D-  (via drill 0.38)
  Top 0.254: v78.31,100.21 78.13,100.39 75.93,100.39 | 75.87,100.39 75.93,100.39 | 75.93,100.39 U14.13
  Bottom 0.254: v78.31,100.21 85.7,100.24 91.9,95.16 92.63,95.16 94.52,92.76 U$2.P14-8
15A+
  Top 0.254: U$2.P15-1 101.13,106.73 101.07,106.66 98.86,106.66 95.68,103.39 91.24,103.39 87.84,106.18 81.79,106.18 U15.2
15A-
  Top 0.254: U$2.P15-2 98.59,108 98.65,107.88 98.65,107.35 95.4,103.9 91.52,103.9 88.03,106.83 81.79,106.83 U15.3
15B+
  Top 0.254: U$2.P15-3 101.13,109.27 100,110.29 100,113.32 99.09,114.23 97.87,114.23 96.93,113.04 96.93,107.1 94.95,104.94 92.08,104.94 87.83,108.78 81.79,108.78 U15.6
15B-
  Top 0.254: U$2.P15-6 98.59,113.08 97.46,111.72 97.49,106.92 95.17,104.4 91.75,104.4 87.62,108.13 81.79,108.13 U15.5
15C+  (via drill 0.38)
  Top 0.254: v78,109.59 77.85,109.44 U15.10
  Bottom 0.254: v78,109.59 87.45,109.59 92.05,105.57 95.25,105.57 96.77,107.2 96.77,108.49 98.49,110.43 | 98.49,110.43 98.59,110.54 | U$2.P15-4 98.59,110.52 98.49,110.43
15C-  (via drill 0.38)
  Top 0.254: v78.1,108.68 77.86,108.79 U15.11
  Bottom 0.254: v78.1,108.68 87.48,108.63 91.87,104.86 95.33,104.86 97.33,106.97 97.33,108.26 98.22,109.23 99.34,109.23 101.13,111.81 U$2.P15-5
15D+  (via drill 0.38)
  Top 0.254: v77.95,106.52 77.63,106.84 U15.14
  Bottom 0.254: v77.95,106.52 87.53,106.52 91.47,103.49 100.74,103.49 103.1,105.93 103.1,112.37 101.13,114.35 U$2.P15-7
15D-  (via drill 0.38)
  Top 0.254: v78.81,107.28 76.07,107.33 76.07,107.49 U15.13
  Bottom 0.254: v78.81,107.28 87.7,107.33 91.72,104.12 100.36,104.12 102.44,106.28 102.44,112.15 101.55,113.01 101.01,113.01 99.16,114.67 98.59,115.27 U$2.P15-8
16A+
  Top 0.254: 81.79,113.06 81.89,113.06 | 81.89,113.06 84.71,113.06 90.2,108.49 90.2,107.45 92.46,105.44 94.77,105.44 96.42,107.27 96.42,114.41 95,115.73 92.1,115.73 91.98,115.62 U$2.P16-1 | U16.2 81.87,113.08 81.89,113.06
16A-
  Top 0.254: 81.79,113.71 81.81,113.71 | 81.81,113.71 84.95,113.71 90.6,109.03 92.89,109.03 94.01,107.91 94.79,107.91 95.71,108.82 95.71,113.16 94.52,114.35 U$2.P16-2 | U16.3 81.8,113.73 81.81,113.71
16B+
  Top 0.254: U$2.P16-3 91.98,113.08 88.45,115.66 81.79,115.66 U16.6
16B-
  Top 0.254: U$2.P16-6 94.54,109.28 94.53,109.27 94.52,109.27 94.13,109.53 90.96,109.53 84.51,115.01 81.79,115.01 U16.5
16C+  (via drill 0.38)
  Top 0.254: v78.31,116.49 78.12,116.31 | 78.12,116.31 75.87,116.31 75.89,116.33 U16.10 | 78.15,116.31 78.12,116.31
  Bottom 0.254: v78.31,116.49 86,116.52 91.64,111.74 94.46,111.74 94.52,111.81 U$2.P16-4
16C-  (via drill 0.38)
  Top 0.254: v78.18,115.6 78.12,115.66 75.93,115.66 | 75.87,115.66 75.93,115.66 | 75.93,115.66 U16.11
  Bottom 0.254: v78.18,115.6 85.92,115.6 91.98,110.54 U$2.P16-5
16D+  (via drill 0.38)
  Top 0.254: v77.7,113.52 77.51,113.71 75.93,113.71 | 75.87,113.71 75.93,113.71 | 75.93,113.71 U16.14
  Bottom 0.254: v77.7,113.52 85.34,113.5 91.98,108 U$2.P16-7
16D-  (via drill 0.38)
  Top 0.254: v78.31,114.18 78.13,114.36 75.93,114.36 | 75.87,114.36 75.93,114.36 | 75.93,114.36 U16.13
  Bottom 0.254: v78.31,114.18 85.7,114.21 91.9,109.13 92.63,109.13 94.52,106.73 U$2.P16-8
CK0-1  (via drill 0.51)
  Top 0.254: v73.53,10.68 73.53,10.17 75.34,8.37 75.93,8.37 U1.15 | U2.15 75.52,15.27 v73.58,17.21
  Bottom 0.254: U17.18 44.81,63.1 66.07,41.84 66.07,18.15 67.01,17.21 | 67.01,17.21 v73.53,10.68 | v73.58,17.21 67.01,17.21
CK0-2  (via drill 0.51)
  Top 0.254: v73.58,25.05 73.58,24.22 75.41,22.39 U3.15 | U4.15 75.36,29.27 v74.24,30.39
  Bottom 0.254: U17.17 45.02,63.75 70.84,37.93 70.84,34.2 | 70.84,34.2 70.84,27.8 v73.58,25.05 | v74.24,30.39 74.24,30.79 70.84,34.2
CK0-3  (via drill 0.51)
  Top 0.254: v73.48,38.34 73.48,38.16 75.29,36.36 75.94,36.36 U5.15 | U6.15 75.49,43.23 v74.14,44.59
  Bottom 0.254: U17.16 47.42,64.4 67.23,44.59 | 67.23,44.59 v73.48,38.34 | v74.14,44.59 67.23,44.59
CK0-4  (via drill 0.51)
  Top 0.254: v72.95,52.59 73.05,52.59 75.29,50.35 75.93,50.35 U7.15 | U8.15 75.4,57.23 v74.02,58.61
  Bottom 0.254: U17.15 60.48,65.05 66.93,58.61 | 66.93,58.61 v72.95,52.59 | v74.02,58.61 66.93,58.61
CK1-1  (via drill 0.51)
  Top 0.254: v74.22,65.64 74.22,65.47 75.41,64.27 75.93,64.27 U9.15 | U10.15 75.79,71.16 75.77,71.18 75.41,71.18 v74.42,72.17
  Bottom 0.254: U17.14 62.97,65.7 | 62.97,65.7 74.16,65.7 v74.22,65.64 | v74.42,72.17 69.43,72.17 62.97,65.7
CK1-2  (via drill 0.51)
  Top 0.254: v74.22,80.25 74.22,79.36 75.34,78.24 U11.15 | U12.15 75.36,85.11 v74.47,85.99
  Bottom 0.254: U17.13 53.9,66.35 68.66,81.11 | 68.66,81.11 73.36,81.11 v74.22,80.25 | v74.47,85.99 74.04,85.99 73.46,86.57 70.1,86.6 68.63,84.69 68.63,81.14 68.66,81.11
CK1-3  (via drill 0.51)
  Top 0.254: U13.15 75.37,92.2 74.8,92.77 74.8,93.35 v74.4,93.76 | U14.15 75.34,99.07 74.78,99.63 74.78,99.98 v74.37,100.39
  Bottom 0.254: U17.12 48.58,67 68.78,87.21 68.78,92.19 68.81,92.21 | 68.81,92.21 71.07,94.47 | 71.07,94.47 73.69,94.47 v74.4,93.76 | 71.22,94.62 71.07,94.47 | v74.37,100.39 73.63,100.44 72.67,101.13 70,101.1 68.81,99.25 68.81,92.21
CK1-4  (via drill 0.51)
  Top 0.254: v74.47,108.49 74.9,108.06 74.9,106.77 75.48,106.19 U15.15 | U16.15 75.43,113.08 v74.47,114.03
  Bottom 0.254: U17.11 48.29,67.65 66.24,85.61 66.24,103.64 66.95,104.35 | 66.95,104.35 71.88,109.28 73.69,109.28 v74.47,108.49 | v74.47,114.03 72.54,114.77 71.78,115.12 68.66,115.12 66.95,112.3 66.95,104.35
GND  (via drill 0.51)
  Bottom 0.254: 42.57,63.33 42.16,63.74 42.16,65.39 39.93,67.62 38.51,67.62 U17.10 37.41,67.65 v36.27,68.79 | 42.57,63.33 43.45,62.45 U17.19 | C17.2 42.57,60.17 42.57,63.33 | v54.58,98.16 v54.58,100.9 | v55.96,112.07 55.96,114.74 v55.91,114.79
  Bottom 0.508: U$2.SH@1 97.57,4.9 U$2.SH@2
  pour Top: 0.46,126.22 116.89,126.22 116.89,-2.25 0.15,-2.25 0.15,126.27
PRU0
  Bottom 0.254: U$3.11 37.44,59.67 37.44,61.88 38.01,62.45 U17.2 U17.3 U17.4 U17.5
PRU1
  Bottom 0.254: U$3.27 39.93,41.83 39.93,64.12 38.99,65.05 U17.6 U17.7 U17.8 U17.9
S0
  Top 0.254: U$3.8 42.46,6.46 79.27,6.46 80.55,7.74 U1.1
S1
  Top 0.254: U$3.12 39.16,15.4 52.81,15.4 55.96,12.84 79.48,12.86 80.7,11.64 U1.7
S2
  Top 0.254: U$3.10 37.77,14.78 45.25,14.78 48.39,14.77 52.58,14.77 55.65,12.28 U1.9
S3
  Top 0.254: U$3.14 40.25,17.1 52.73,17.1 56.41,14.08 79.55,14.08 80.09,14.62 U2.1
S4
  Top 0.254: U$3.18 41.87,19.75 79.55,19.75 80.78,18.52 U2.7
S5
  Top 0.254: U$3.16 39.91,19.17 U2.9
S6
  Top 0.254: U$3.26 50.51,21.27 78.89,21.27 79.36,21.73 U3.1
S7
  Top 0.254: U$3.30 50.05,26.81 79.45,26.81 80.62,25.63 U3.7
S8
  Top 0.254: U$3.28 48.04,26.28 U3.9
S9
  Top 0.254: U$3.32 51.27,28.13 79.53,28.13 80.02,28.62 U4.1
S10
  Top 0.254: U$3.36 52.11,32.37 70.94,32.37 72.29,33.72 79.48,33.72 80.67,32.52 U4.7
S11
  Top 0.254: U$3.34 50.18,31.76 73.91,31.76 75.32,33.17 U4.9
S12
  Top 0.254: U$3.38 53.53,33.46 69.7,33.46 71.43,35.21 79.6,35.21 80.11,35.72 U5.1
S13
  Top 0.254: U$3.42 56.96,35.16 67.46,35.16 72.8,40.78 79.58,40.78 80.74,39.62 U5.7
S14
  Top 0.254: U$3.40 54.9,34.63 67.77,34.63 73.33,40.27 U5.9
S15
  Top 0.254: U$3.46 60.36,36.81 67.01,36.81 72.21,42.02 79.27,42.02 79.84,42.58 U6.1
S16
  Top 0.254: U$3.44 59.21,38.25 59.21,39.81 67.11,47.71 79.27,47.71 80.5,46.48 U6.7
S17
  Top 0.254: U$3.45 68.09,47.13 U6.9
S18
  Top 0.254: U$3.43 67.52,49.11 79.12,49.11 79.7,49.69 U7.1
S19
  Top 0.254: U$3.39 68.11,54.77 79.55,54.77 80.74,53.59 U7.7
S20
  Top 0.254: U$3.41 70.11,54.24 U7.9
S21
  Top 0.254: U$3.37 66.81,56.02 79.6,56.02 80.16,56.58 U8.1
S22
  Top 0.254: U$3.33 67.34,61.63 79.71,61.63 80.86,60.48 U8.7
S23
  Top 0.254: U$3.35 69.38,61.13 U8.9
S24
  Top 0.254: U$3.31 42.61,39.43 42.82,39.43 66.5,63.1 79.6,63.1 80.14,63.64 U9.1
S25
  Top 0.254: U$3.19 56.65,68.72 79.76,68.72 80.94,67.54 U9.7
S26
  Top 0.254: U$3.29 68.82,68.19 U9.9
S27
  Top 0.254: U$3.17 55.38,69.99 79.65,69.99 80.17,70.51 U10.1
S28
  Top 0.254: U$3.13 55.89,75.57 79.32,75.57 80.49,74.41 U10.7
S29
  Top 0.254: U$3.15 57.91,75.06 U10.9
S30
  Top 0.254: U$3.9 52.28,77.05 80.11,77.05 80.65,77.59 U11.1
S31
  Top 0.254: U$3.88 57.7,82.66 79.4,82.66 80.57,81.49 U11.7
S32
  Top 0.254: U$3.7 54.83,82.14 U11.9
S33
  Top 0.254: U$3.87 56.63,89.01 63.07,89.01 68.15,83.93 79.3,83.93 79.82,84.46 U12.1
S34
  Top 0.254: U$3.76 41.28,86.36 41.28,89.04 45.72,93.48 66.27,93.48 69.75,90 75.24,90 75.69,89.54 79.07,89.54 80.26,88.36 U12.7
S35
  Top 0.254: U12.9 74.86,89.01 74.32,89.54 68.99,89.54 66.01,92.52 47.43,92.52 U$3.77
S36
  Top 0.254: U$3.75 40.64,88.27 40.64,90.1 44.81,94.27 66.6,94.27 69.98,90.89 79.55,90.89 80.21,91.55 U13.1
S37
  Top 0.254: U$3.74 36.32,86.26 36.32,91.86 41.17,96.71 78.92,96.71 80.17,95.45 U13.7
S38
  Top 0.254: U$3.73 38.13,88.29 38.13,92.14 42.09,96.1 U13.9
S39
  Top 0.254: U$3.71 35.08,87.78 35.08,92.47 40.54,97.93 45.19,97.93 46.76,99.5 56.9,99.5 58.39,98 78.97,97.93 79.46,98.42 U14.1
S40
  Top 0.254: U$3.70 31.17,86.33 31.17,97.34 37.36,103.54 78.89,103.54 80.11,102.32 U14.7
S41
  Top 0.254: U$3.69 32.77,88.01 32.77,95.62 40.12,102.97 U14.9
S42
  Top 0.254: U$3.62 23.5,86.37 25.53,86.37 26.11,86.95 26.11,100.19 30.89,104.96 79.86,104.96 80.44,105.54 U15.1
S43
  Top 0.254: U$3.60 20.98,86.39 20.98,104.99 26.62,110.63 44.15,110.63 46.18,108.59 57.61,108.59 59.69,110.68 79.65,110.63 80.84,109.44 U15.7
S44
  Top 0.254: U$3.61 22.12,87.75 22.12,101.74 30.48,110.09 43.99,110.09 46.08,108.01 57.86,108.01 59.92,110.07 U15.9
S45
  Top 0.254: U$3.59 19.63,87.7 19.63,107.98 23.47,111.82 32.97,111.82 34.42,113.27 45.87,113.27 47.45,115.1 52.35,115.1 53.9,113.29 60.55,113.27 62,111.82 79.83,111.82 80.44,112.43 U16.1
S46
  Top 0.254: U$3.58 15.82,86.43 15.82,114.23 19.25,117.66 79.63,117.66 80.96,116.33 U16.7
S47
  Top 0.254: U$3.57 16.97,87.83 16.97,112.33 21.62,116.98 U16.9
SYS_5V  (1 unrouted)
VCC  (via drill 0.51)
  Top 0.254: U4.4 80.46,30.57 80.26,30.77 | 80.26,30.77 79.91,31.12 76.86,31.12 76.78,31.2 76.28,31.2 U4.12 | 80.26,30.77 78.11,28.62 U4.16 74.27,28.62 C4.1 73.92,29.11 v72.11,30.92 | U3.4 80.04,23.68 | 80.04,23.68 79.6,24.2 76.52,24.2 U3.12 | 80.04,23.68 78.09,21.73 U3.16 74.36,21.73 C3.1 73.98,22.47 v72.31,24.14 | U5.4 80.33,37.67 | 80.33,37.67 79.86,38.19 76.25,38.19 U5.12 | 80.33,37.67 78.38,35.72 U5.16 74.26,35.72 C5.1 73.9,36.27 v72.24,37.93 | U6.4 79.63,44.53 | 79.63,44.53 79.12,45.15 76.01,45.15 U6.12 | 79.63,44.53 77.68,42.58 U6.16 74.23,42.58 C6.1 73.9,43.08 72.92,44.05 70.33,44.05 v70.05,43.77 | U15.4 80.33,107.49 | 80.33,107.49 79.86,107.98 76.25,107.98 76.07,108.14 U15.12 | U15.16 78.38,105.54 80.33,107.49 | 79.63,114.36 81.77,114.36 U16.4 | 79.63,114.36 79.15,114.84 76.04,114.84 75.87,115.01 75.93,115.01 U16.12 | 79.63,114.36 77.68,112.41 75.95,112.41 U16.16 74.26,112.43 C16.1 73.92,113.03 72.92,114.03 71.35,114.03 v70.1,113.75 | 81.8,93.52 80.33,93.52 | 80.33,93.52 79.88,94.01 76.25,94.01 76.07,94.17 75.97,94.17 U13.12 | 80.33,93.52 78.38,91.57 75.97,91.57 U13.16 74.25,91.55 C13.1 73.9,92.54 73.25,93.18 72.19,93.18 v72.01,93.35 | 79.63,100.39 81.77,100.39 U14.4 | 79.63,100.39 79.15,100.87 76.04,100.87 75.87,101.04 75.93,101.04 U14.12 | 75.93,98.44 77.68,98.44 79.63,100.39 | 81.8,79.55 80.35,79.55 | 80.35,79.55 79.88,80.07 76.28,80.07 76.1,80.2 76.08,80.19 U11.12 | 75.96,77.6 78.4,77.6 80.35,79.55 | 79.66,86.42 81.77,86.42 U12.4 | 79.66,86.42 79.17,86.9 76.06,86.9 75.89,87.07 75.94,87.07 U12.12 | 75.94,84.47 77.71,84.47 79.66,86.42 | U9.4 80.35,65.58 | 80.35,65.58 79.88,66.07 76.28,66.07 76.1,66.23 U9.12
  Top 0.254: U9.16 78.4,63.63 80.35,65.58 | 79.66,72.45 81.73,72.45 81.74,72.46 U10.4 | 79.66,72.45 79.17,72.93 76.06,72.93 75.89,73.1 U10.12 | U10.16 77.71,70.5 79.66,72.45 | 81.8,9.7 80.35,9.7 | 80.35,9.7 79.88,10.17 76.28,10.17 76.1,10.35 75.96,10.35 U1.12 | 80.35,9.7 78.4,7.75 76.1,7.75 arc-90 76.08,7.74 U1.16 74.26,7.74 arc-90 C1.1 73.92,8.41 v72.26,10.07 | 79.66,16.57 U2.4 | 79.66,16.57 79.17,17.05 76.06,17.05 75.89,17.22 U2.12 | U2.16 77.71,14.62 79.66,16.57 | U15.16 | 81.91,107.49 U15.4 | U15.4 | U8.4 79.99,58.53 | 79.99,58.53 79.5,59.09 76.11,59.09 U8.12 | 79.99,58.53 78.04,56.58 U8.16 74.29,56.58 C8.1 73.92,57.2 73.03,58.1 71.12,58.1 v70.59,57.57 | U7.4 79.91,51.64 | 79.91,51.64 79.74,51.64 79.3,52.18 76.16,52.18 U7.12 | 79.91,51.64 77.96,49.69 U7.16 74.27,49.69 C7.1 73.92,50.42 72.67,51.67 70.49,51.67 v70.38,51.57 | 81.91,93.52 81.8,93.52 | 81.8,93.52 U13.4 | 75.94,84.47 U12.16 | 81.93,79.55 81.8,79.55 | 81.8,79.55 U11.4 | 75.96,77.6 U11.16 | U10.16 | 81.93,65.58 U9.4 | U9.4 | U9.16 | U2.16 | 81.93,9.7 81.8,9.7 | 81.8,9.7 U1.4 | U2.16 74.27,14.62 arc-90 C2.1 73.92,15.19 72.95,16.16 72.14,16.16 v71.88,16.42 | U9.16 74.3,63.63 C9.1 72.94,64.98 70.51,64.98 70,64.47 v70,64.4 | U10.16 74.26,70.5 C10.1 73.1,71.66 70.76,71.66 70.16,71.05 v70.23,71.33 | 75.96,77.6 74.25,77.6 C11.1 73.95,78.29 73.15,79.08 70.28,79.08 v70.21,79 | 75.94,84.47 74.24,84.47 C12.1 73.92,85.12 72.97,86.06 71.86,86.06 v70.87,85.76 | 75.93,98.44 U14.16 | 75.93,98.44 74.22,98.44 C14.1 73.92,98.96 73.1,99.78 71.17,99.78 v70.61,99.55 | U15.16 74.26,105.54 C15.1 73.92,105.92 v72.26,107.58
  Bottom 0.254: v70.23,71.33 69.62,70.49 69.62,70.39
  pour Bottom: 0.25,126.37 116.92,126.37 116.92,-2.56 0,-2.56 0,126.12
VDD_3V3EXP  (1 unrouted)

### Text on the board
tPlace: 16 | 15 | 14 | 13 | 12 | 11 | 10 | 9 | 8 | 7 | 6 | 5 | 4 | 3 | 2 | 2016 | Rev. A | 1 | Shlomo Zippel | Designed by